# EAGLE design Quad_Board (EAGLE 6.5.0)
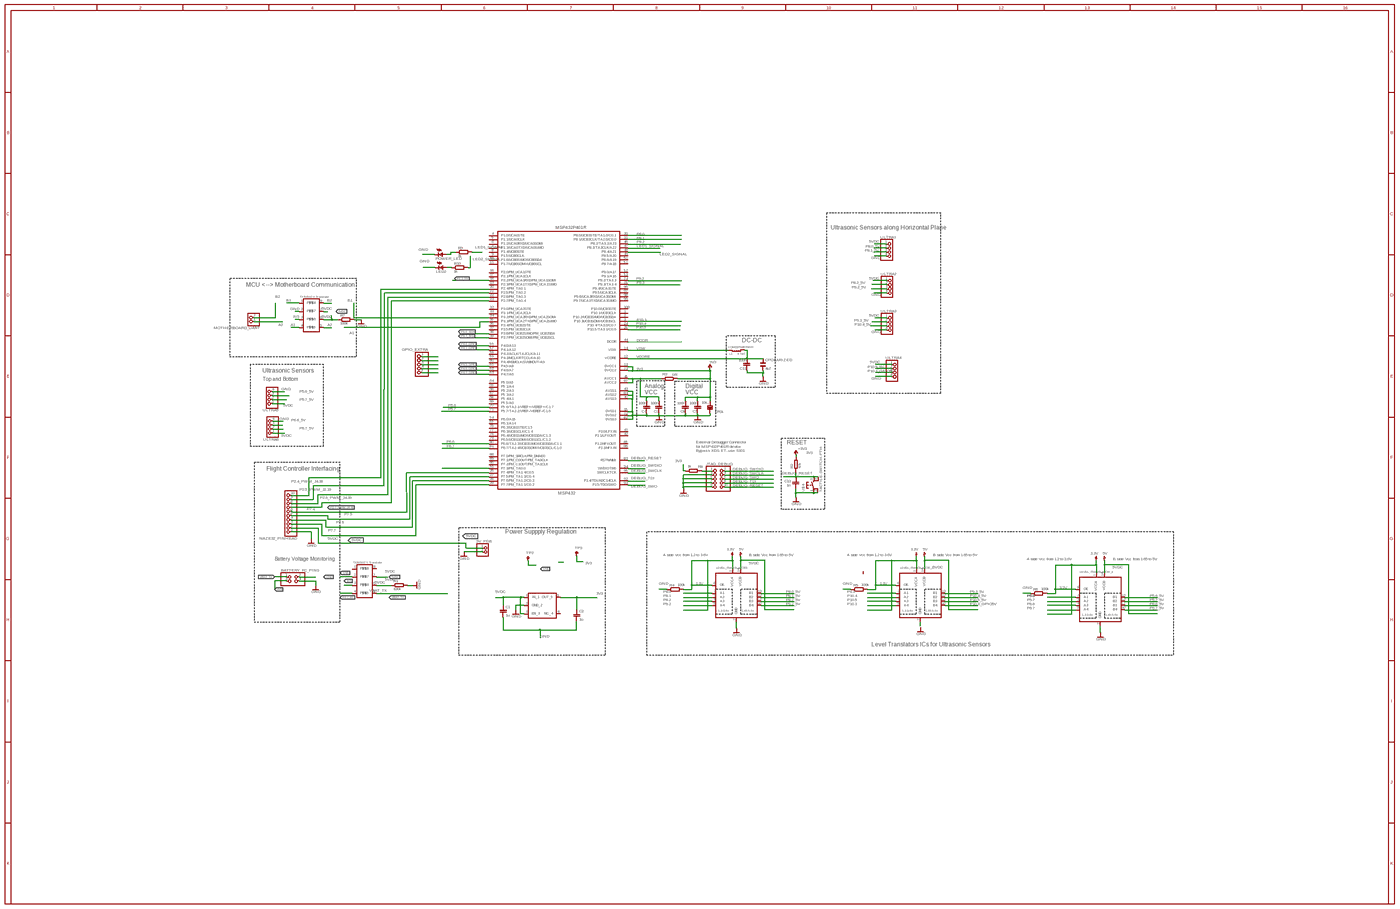
[diagram p0: schematic, sheet 1, overview]
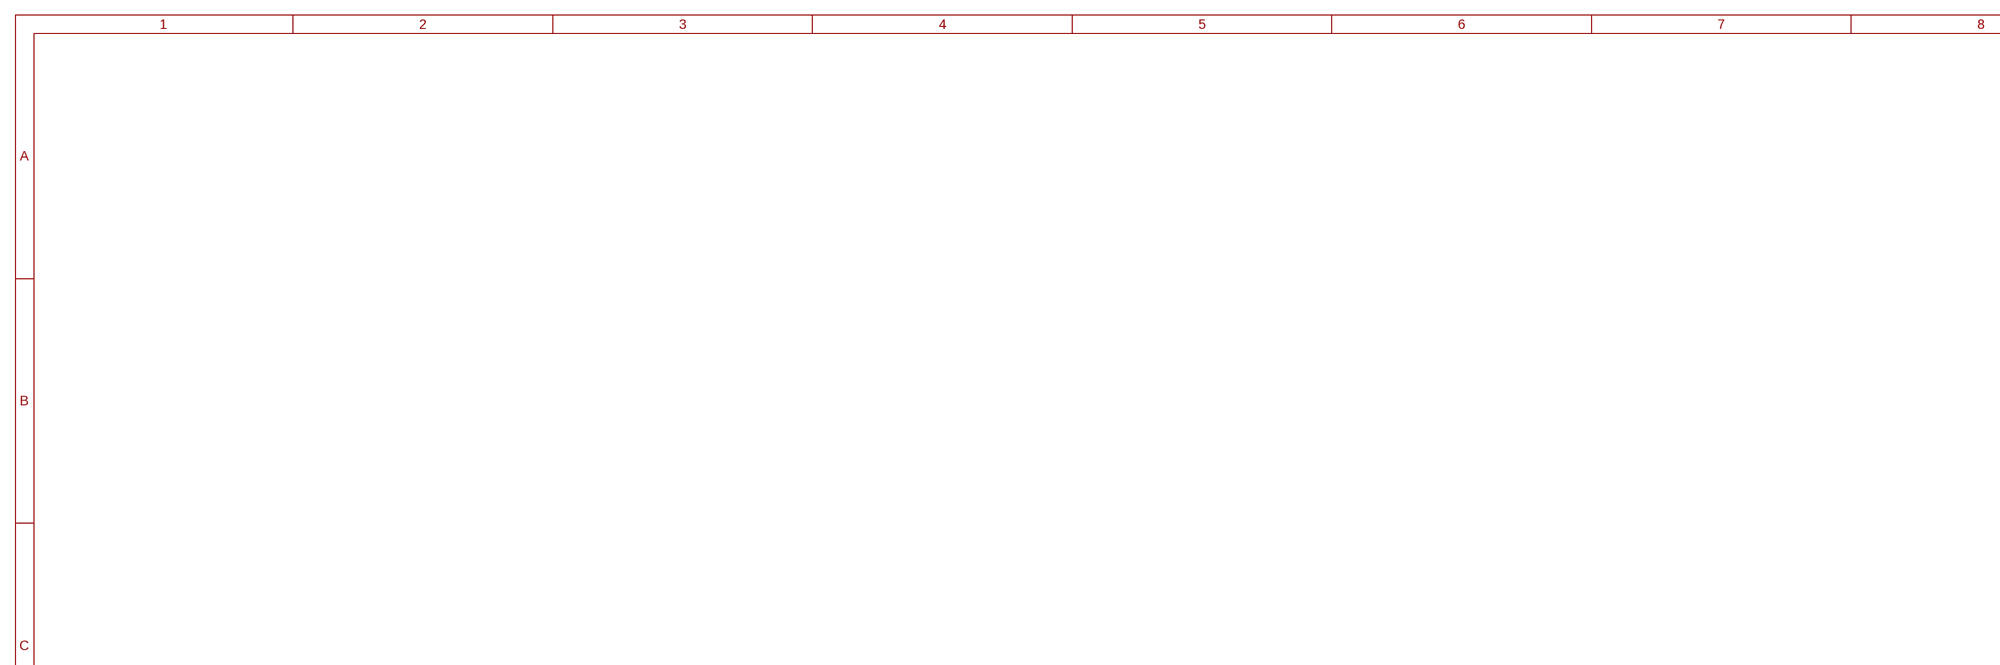
[diagram p1: schematic, sheet 1, part 1 of 4]
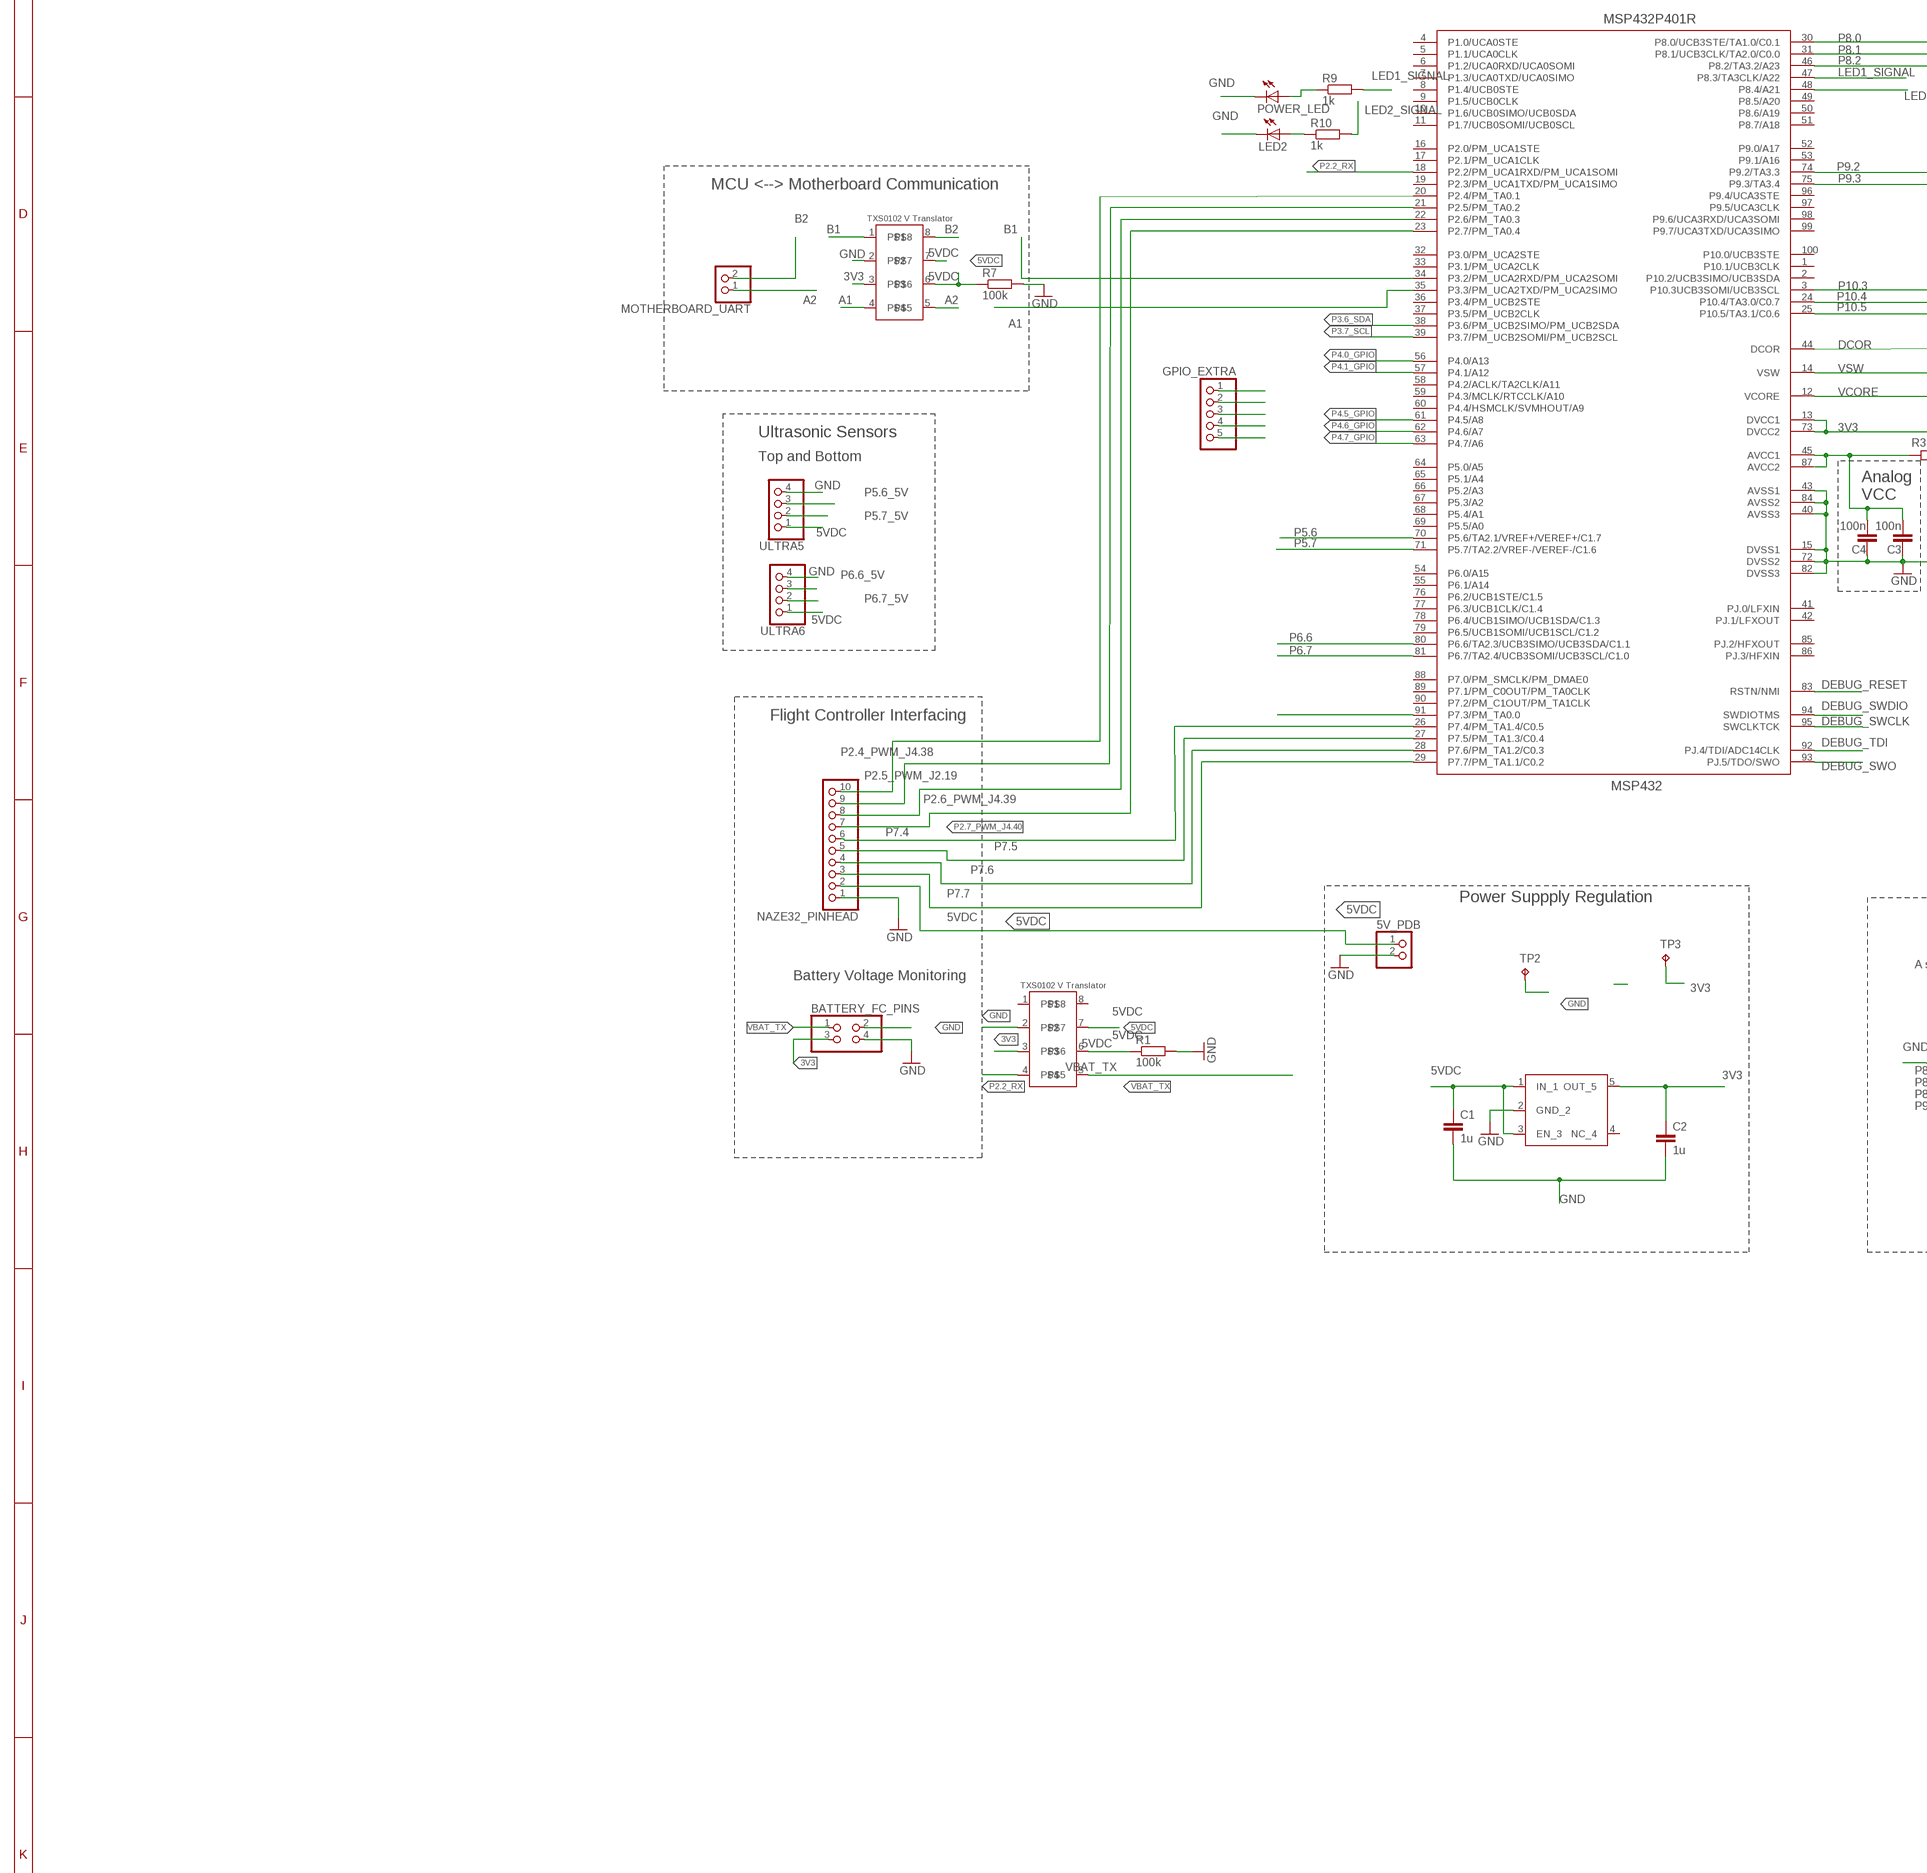
[diagram p2: schematic, sheet 1, part 2 of 4]
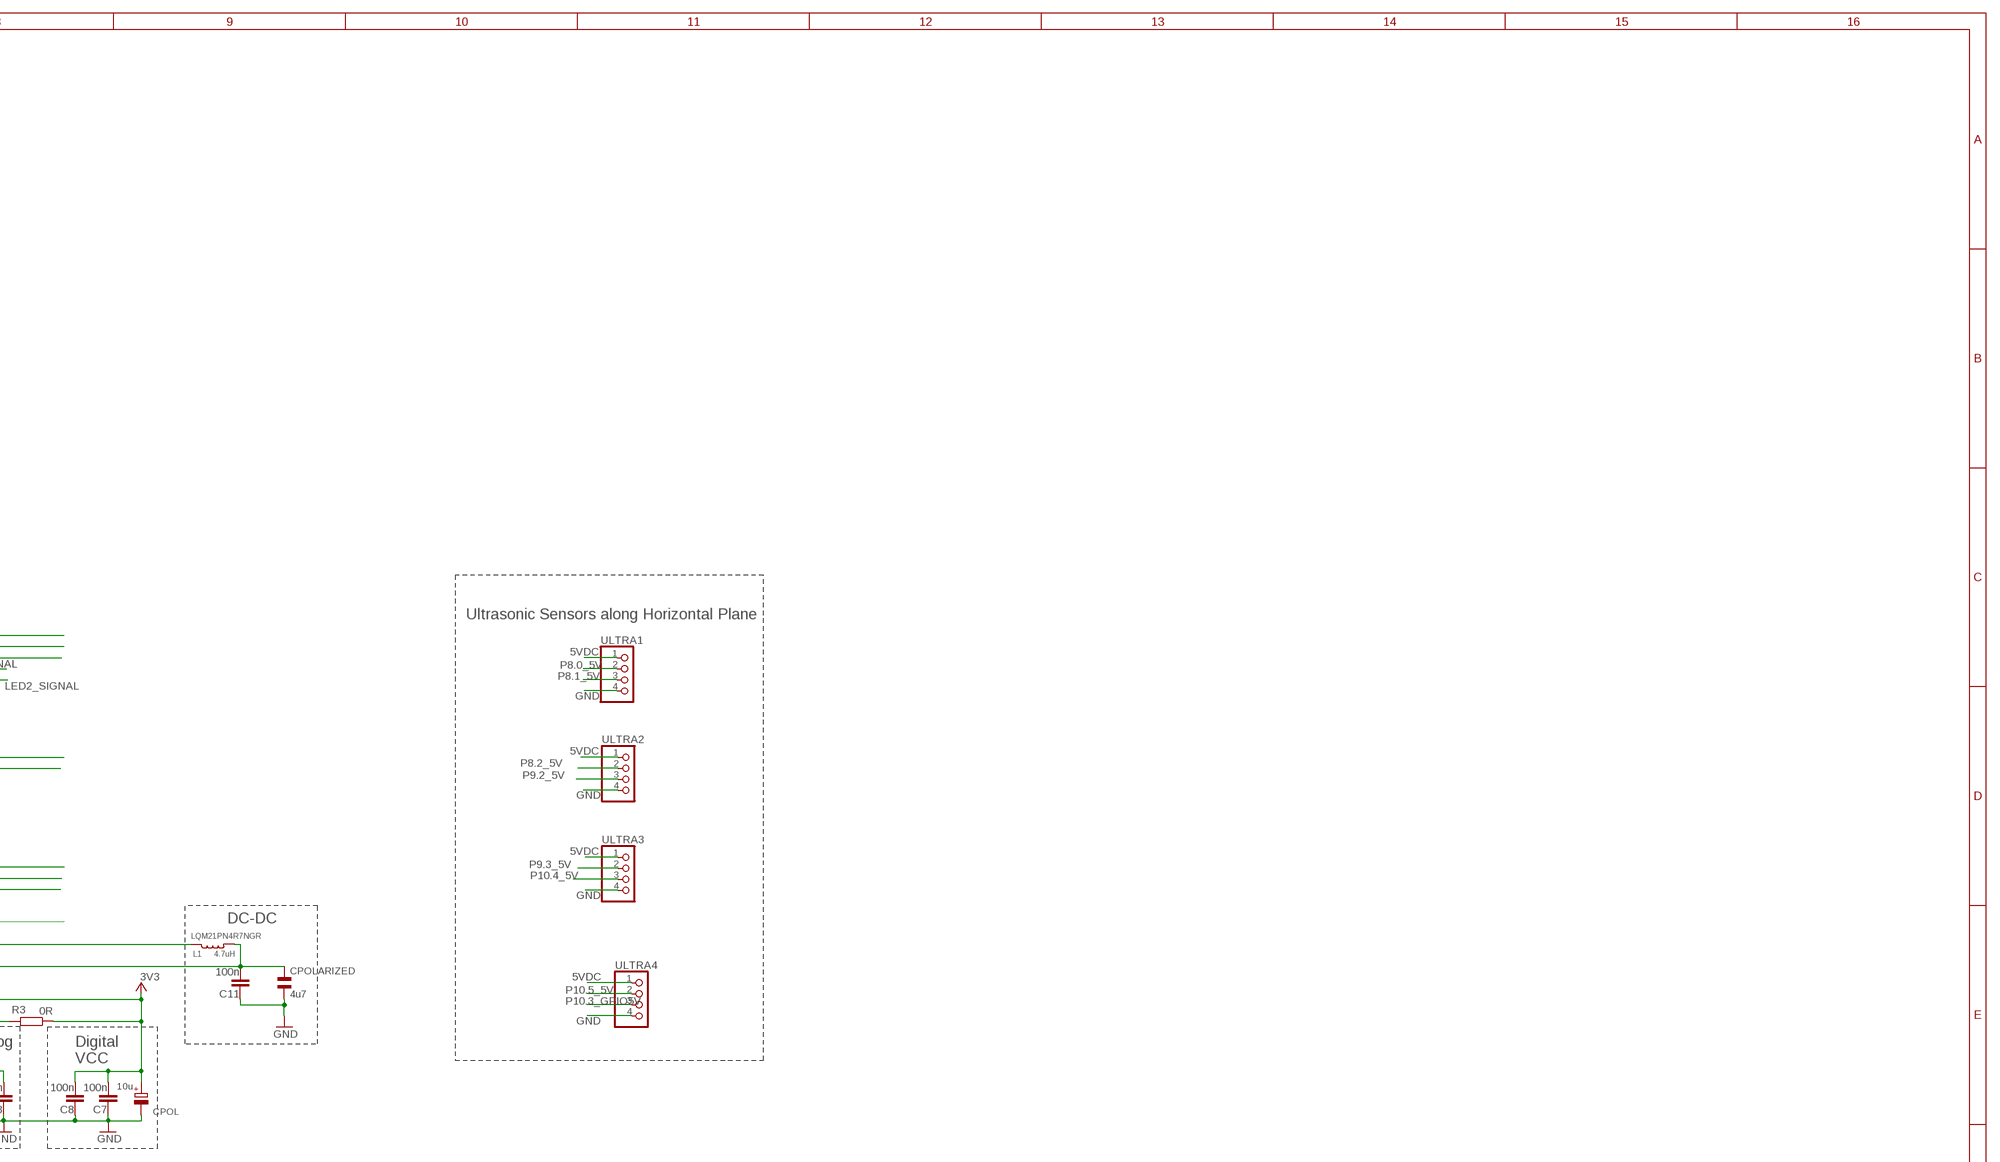
[diagram p3: schematic, sheet 1, part 3 of 4]
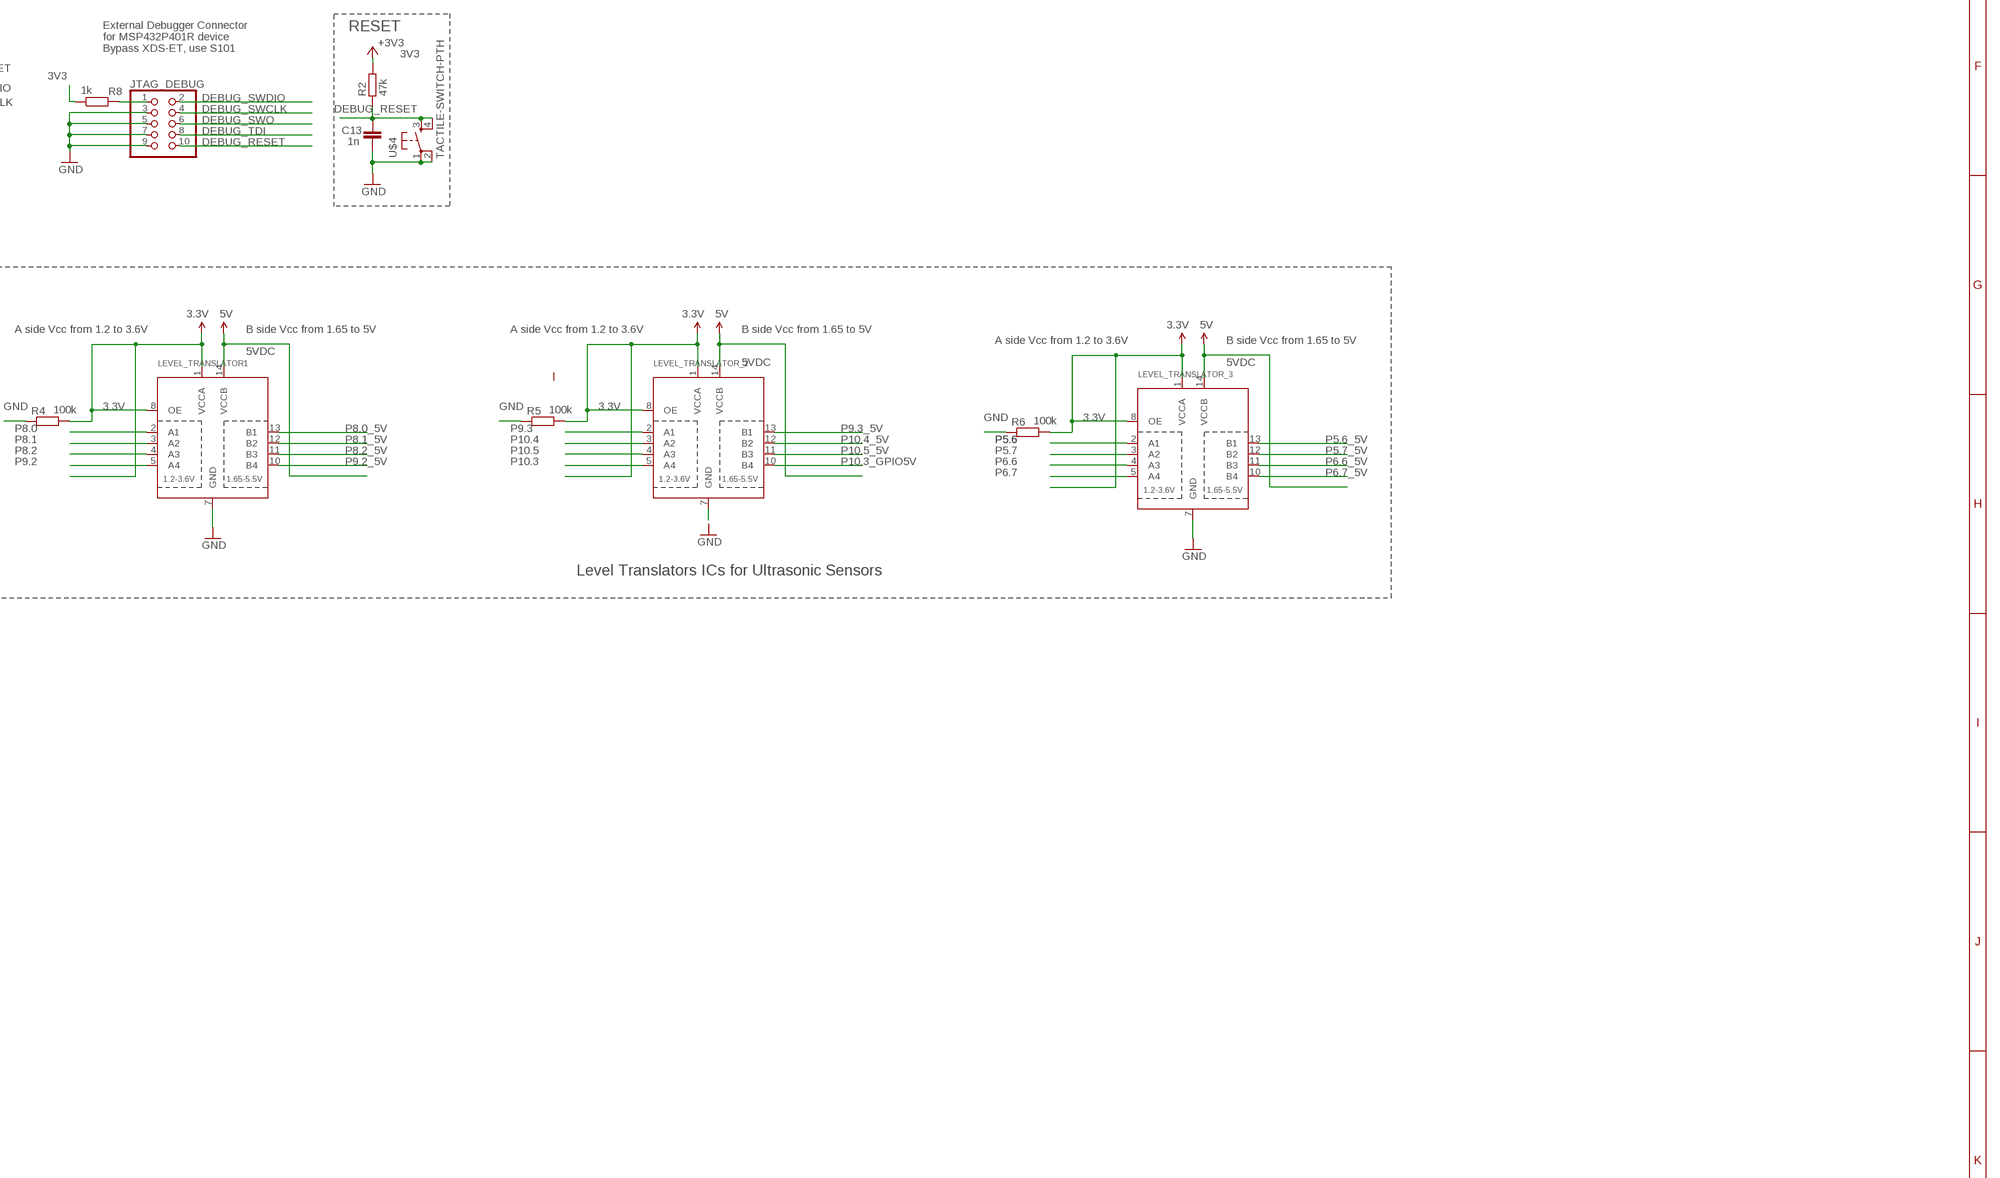
[diagram p4: schematic, sheet 1, part 4 of 4]

## Parts
5V_PDB  PINHD-1X2  [1X02]
BATTERY_FC_PINS  PINHD-2X2  [2X02]
C1  1u  C-EUC0805  [C0805]
C2  1u  C-EUC0805  [C0805]
C3  100n  C-EUC0805  [C0805]
C4  100n  C-EUC0805  [C0805]
C7  100n  C-EUC0805  [C0805]
C8  100n  C-EUC0805  [C0805]
C11  100n  C-EUC0805  [C0805]
C13  1n  C-EUC0805  [C0805]
CPOL  10u  CPOL-EUA/3216-18R  [A/3216-18R]
CPOLARIZED  4u7  CSMD0805  [CSMD0805]
GPIO_EXTRA  PINHD-1X5  [1X05]
JTAG_DEBUG  PINHD-2X5  [2X05]
L1  4.7uH  LQM2MP_G0  [0806]
LED2  LED_E  [LED_1206]
LEVEL_TRANSLATOR1  TXB0104PWRSOIC14  [SO14]
LEVEL_TRANSLATOR_2  TXB0104PWRSOIC14  [SO14]
LEVEL_TRANSLATOR_3  TXB0104PWRSOIC14  [SO14]
MOTHERBOARD_UART  PINHD-1X2  [1X02]
MSP432P401R  MSP432  [PZ100]
NAZE32_PINHEAD  PINHD-1X10  [1X10]
POWER_LED  LED_E  [LED_1206]
R1  100k  R-EU_M1206  [M1206]
R2  47k  R-EU_R1206  [R1206]
R3  0R  R-EU_RM0402  [0402]
R4  100k  R-EU_M1206  [M1206]
R5  100k  R-EU_M1206  [M1206]
R6  100k  R-EU_M1206  [M1206]
R7  100k  R-EU_M1206  [M1206]
R8  1k  R-EU_R1206  [R1206]
R9  1k  R-EU_M0805  [M0805]
R10  1k  R-EU_M0805  [M0805]
TP2  TPB2,54  [B2,54]
TP3  TPB2,54  [B2,54]
U$1  TXS0102  [DCT_R-PDSO-G8]
U$2  TLV733P  [SOT23-5]
U$3  TXS0102  [DCT_R-PDSO-G8]
U$4  TACTILE-SWITCH-PTH  [TAC-SWITCH-PTH]
ULTRA1  PINHD-1X4  [1X04]
ULTRA2  PINHD-1X4  [1X04]
ULTRA3  PINHD-1X4  [1X04]
ULTRA4  PINHD-1X4  [1X04]
ULTRA5  PINHD-1X4  [1X04]
ULTRA6  PINHD-1X4  [1X04]

## Nets
3.3V: LEVEL_TRANSLATOR1.1(VCCA) LEVEL_TRANSLATOR1.8(OE) LEVEL_TRANSLATOR_2.1(VCCA) LEVEL_TRANSLATOR_2.8(OE) LEVEL_TRANSLATOR_3.1(VCCA) LEVEL_TRANSLATOR_3.8(OE) R4.2 R5.2 R6.2
3V3: BATTERY_FC_PINS.3 C2.1 C7.1 C8.1 CPOL.+ MSP432P401R.13(DVCC1) MSP432P401R.73(DVCC2) R2.2 R3.1 R8.1 TP3.TP U$1.3 U$2.5(OUT_5) U$3.3 ; supply symbol labelled +3V3
5VDC: 5V_PDB.1 C1.1 LEVEL_TRANSLATOR1.14(VCCB) LEVEL_TRANSLATOR_2.14(VCCB) LEVEL_TRANSLATOR_3.14(VCCB) NAZE32_PINHEAD.2 R1.1 R7.1 U$1.6 U$1.7 U$2.1(IN_1) U$2.3(EN_3) U$3.6 U$3.7 ULTRA1.1 ULTRA2.1 ULTRA3.1 ULTRA4.1 ULTRA5.1 ULTRA6.1 ; supply symbol labelled 5V
A1: MSP432P401R.35(P3.3/PM_UCA2TXD/PM_UCA2SIMO) U$1.4
A2: MOTHERBOARD_UART.1 U$1.5
B1: MSP432P401R.34(P3.2/PM_UCA2RXD/PM_UCA2SOMI) U$1.1
B2: MOTHERBOARD_UART.2 U$1.8
DCOR: MSP432P401R.44(DCOR)
DEBUG_RESET: C13.1 JTAG_DEBUG.10 MSP432P401R.83(RSTN/NMI) R2.1 U$4.3 U$4.4
DEBUG_SWCLK: JTAG_DEBUG.4 MSP432P401R.95(SWCLKTCK)
DEBUG_SWDIO: JTAG_DEBUG.2 MSP432P401R.94(SWDIOTMS)
DEBUG_SWO: JTAG_DEBUG.6 MSP432P401R.93(PJ.5/TDO/SWO)
DEBUG_TDI: JTAG_DEBUG.8 MSP432P401R.92(PJ.4/TDI/ADC14CLK)
GND: 5V_PDB.2 BATTERY_FC_PINS.2 BATTERY_FC_PINS.4 C1.2 C2.2 C3.2 C4.2 C7.2 C8.2 C11.2 C13.2 CPOL.- CPOLARIZED.2 JTAG_DEBUG.3 JTAG_DEBUG.5 JTAG_DEBUG.7 JTAG_DEBUG.9 LED2.C LEVEL_TRANSLATOR1.7(GND) LEVEL_TRANSLATOR_2.7(GND) LEVEL_TRANSLATOR_3.7(GND) MSP432P401R.15(DVSS1) MSP432P401R.40(AVSS3) MSP432P401R.43(AVSS1) MSP432P401R.72(DVSS2) MSP432P401R.82(DVSS3) MSP432P401R.84(AVSS2) NAZE32_PINHEAD.1 POWER_LED.C R1.2 R4.1 R5.1 R6.1 R7.2 TP2.TP U$1.2 U$2.2(GND_2) U$3.2 U$4.1 U$4.2 ULTRA1.4 ULTRA2.4 ULTRA3.4 ULTRA4.4 ULTRA5.4 ULTRA6.4
LED1_SIGNAL: MSP432P401R.47(P8.3/TA3CLK/A22) R9.2
LED2_SIGNAL: MSP432P401R.48(P8.4/A21) R10.2
N$2: C3.1 C4.1 MSP432P401R.45(AVCC1) MSP432P401R.87(AVCC2) R3.2
N$5: POWER_LED.A R9.1
N$6: LED2.A R10.1
N$14: JTAG_DEBUG.1 R8.2
P2.2_RX: MSP432P401R.18(P2.2/PM_UCA1RXD/PM_UCA1SOMI) U$3.4
P2.4_PWM_J4.38: MSP432P401R.20(P2.4/PM_TA0.1) NAZE32_PINHEAD.10
P2.5_PWM_J2.19: MSP432P401R.21(P2.5/PM_TA0.2) NAZE32_PINHEAD.9
P2.6_PWM_J4.39: MSP432P401R.22(P2.6/PM_TA0.3) NAZE32_PINHEAD.8
P2.7_PWM_J4.40: MSP432P401R.23(P2.7/PM_TA0.4) NAZE32_PINHEAD.7
P3.6_SDA: MSP432P401R.38(P3.6/PM_UCB2SIMO/PM_UCB2SDA)
P3.7_SCL: MSP432P401R.39(P3.7/PM_UCB2SOMI/PM_UCB2SCL)
P4.0_GPIO: GPIO_EXTRA.1 MSP432P401R.56(P4.0/A13)
P4.1_GPIO: GPIO_EXTRA.2 MSP432P401R.57(P4.1/A12)
P4.5_GPIO: GPIO_EXTRA.3 MSP432P401R.61(P4.5/A8)
P4.6_GPIO: GPIO_EXTRA.4 MSP432P401R.62(P4.6/A7)
P4.7_GPIO: GPIO_EXTRA.5 MSP432P401R.63(P4.7/A6)
P5.6: LEVEL_TRANSLATOR_3.2(A1) MSP432P401R.70(P5.6/TA2.1/VREF+/VEREF+/C1.7)
P5.6_5V: LEVEL_TRANSLATOR_3.13(B1) ULTRA5.3
P5.7: LEVEL_TRANSLATOR_3.3(A2) MSP432P401R.71(P5.7/TA2.2/VREF-/VEREF-/C1.6)
P5.7_5V: LEVEL_TRANSLATOR_3.12(B2) ULTRA5.2
P6.6: LEVEL_TRANSLATOR_3.4(A3) MSP432P401R.80(P6.6/TA2.3/UCB3SIMO/UCB3SDA/C1.1)
P6.6_5V: LEVEL_TRANSLATOR_3.11(B3) ULTRA6.3
P6.7: LEVEL_TRANSLATOR_3.5(A4) MSP432P401R.81(P6.7/TA2.4/UCB3SOMI/UCB3SCL/C1.0)
P6.7_5V: LEVEL_TRANSLATOR_3.10(B4) ULTRA6.2
P7.3: MSP432P401R.91(P7.3/PM_TA0.0)
P7.4: MSP432P401R.26(P7.4/PM_TA1.4/C0.5) NAZE32_PINHEAD.6
P7.5: MSP432P401R.27(P7.5/PM_TA1.3/C0.4) NAZE32_PINHEAD.5
P7.6: MSP432P401R.28(P7.6/PM_TA1.2/C0.3) NAZE32_PINHEAD.4
P7.7: MSP432P401R.29(P7.7/PM_TA1.1/C0.2) NAZE32_PINHEAD.3
P8.0: LEVEL_TRANSLATOR1.2(A1) MSP432P401R.30(P8.0/UCB3STE/TA1.0/C0.1)
P8.0_5V: LEVEL_TRANSLATOR1.13(B1) ULTRA1.2
P8.1: LEVEL_TRANSLATOR1.3(A2) MSP432P401R.31(P8.1/UCB3CLK/TA2.0/C0.0)
P8.1_5V: LEVEL_TRANSLATOR1.12(B2) ULTRA1.3
P8.2: LEVEL_TRANSLATOR1.4(A3) MSP432P401R.46(P8.2/TA3.2/A23)
P8.2_5V: LEVEL_TRANSLATOR1.11(B3) ULTRA2.2
P9.2: LEVEL_TRANSLATOR1.5(A4) MSP432P401R.74(P9.2/TA3.3)
P9.2_5V: LEVEL_TRANSLATOR1.10(B4) ULTRA2.3
P9.3: LEVEL_TRANSLATOR_2.2(A1) MSP432P401R.75(P9.3/TA3.4)
P9.3_5V: LEVEL_TRANSLATOR_2.13(B1) ULTRA3.2
P10.3: LEVEL_TRANSLATOR_2.5(A4) MSP432P401R.3(P10.3UCB3SOMI/UCB3SCL)
P10.3_GPIO5V: LEVEL_TRANSLATOR_2.10(B4) ULTRA4.3
P10.4: LEVEL_TRANSLATOR_2.3(A2) MSP432P401R.24(P10.4/TA3.0/C0.7)
P10.4_5V: LEVEL_TRANSLATOR_2.12(B2) ULTRA3.3
P10.5: LEVEL_TRANSLATOR_2.4(A3) MSP432P401R.25(P10.5/TA3.1/C0.6)
P10.5_5V: LEVEL_TRANSLATOR_2.11(B3) ULTRA4.2
VBAT_TX: BATTERY_FC_PINS.1 U$3.5
VCORE: C11.1 CPOLARIZED.1 L1.1 MSP432P401R.12(VCORE)
VSW: L1.2 MSP432P401R.14(VSW)
Unconnected: U$2.4(NC_4) U$3.1 U$3.8

## Notes on the sheet
- Ultrasonic Sensors along Horizontal Plane
- MCU <--> Motherboard Communication
- DC-DC
- LQM21PN4R7NGR
- Ultrasonic Sensors
- Top and Bottom
- Analog | Digital
- VCC | VCC
- RESET
- External Debugger Connector
  for MSP432P401R device
  Bypass XDS-ET, use S101
- Flight Controller Interfacing
- Power Suppply Regulation
- A side Vcc from 1.2 to 3.6V | B side Vcc from 1.65 to 5V | A side Vcc from 1.2 to 3.6V | B side Vcc from 1.65 to 5V
- Battery Voltage Monitoring | A side Vcc from 1.2 to 3.6V | B side Vcc from 1.65 to 5V
- Level Translators ICs for Ultrasonic Sensors

## Power pins joined to a net without a drawn wire
P1.0/UCA0STE: MSP432P401R.4(P1.0/UCA0STE)
P1.1/UCA0CLK: MSP432P401R.5(P1.1/UCA0CLK)
P1.2/UCA0RXD/UCA0SOMI: MSP432P401R.6(P1.2/UCA0RXD/UCA0SOMI)
P1.3/UCA0TXD/UCA0SIMO: MSP432P401R.7(P1.3/UCA0TXD/UCA0SIMO)
P1.4/UCB0STE: MSP432P401R.8(P1.4/UCB0STE)
P1.5/UCB0CLK: MSP432P401R.9(P1.5/UCB0CLK)
P1.6/UCB0SIMO/UCB0SDA: MSP432P401R.10(P1.6/UCB0SIMO/UCB0SDA)
P1.7/UCB0SOMI/UCB0SCL: MSP432P401R.11(P1.7/UCB0SOMI/UCB0SCL)
P2.0/PM_UCA1STE: MSP432P401R.16(P2.0/PM_UCA1STE)
P2.1/PM_UCA1CLK: MSP432P401R.17(P2.1/PM_UCA1CLK)
P2.3/PM_UCA1TXD/PM_UCA1SIMO: MSP432P401R.19(P2.3/PM_UCA1TXD/PM_UCA1SIMO)
P3.0/PM_UCA2STE: MSP432P401R.32(P3.0/PM_UCA2STE)
P3.1/PM_UCA2CLK: MSP432P401R.33(P3.1/PM_UCA2CLK)
P3.4/PM_UCB2STE: MSP432P401R.36(P3.4/PM_UCB2STE)
P3.5/PM_UCB2CLK: MSP432P401R.37(P3.5/PM_UCB2CLK)
P4.2/ACLK/TA2CLK/A11: MSP432P401R.58(P4.2/ACLK/TA2CLK/A11)
P4.3/MCLK/RTCCLK/A10: MSP432P401R.59(P4.3/MCLK/RTCCLK/A10)
P4.4/HSMCLK/SVMHOUT/A9: MSP432P401R.60(P4.4/HSMCLK/SVMHOUT/A9)
P5.0/A5: MSP432P401R.64(P5.0/A5)
P5.1/A4: MSP432P401R.65(P5.1/A4)
P5.2/A3: MSP432P401R.66(P5.2/A3)
P5.3/A2: MSP432P401R.67(P5.3/A2)
P5.4/A1: MSP432P401R.68(P5.4/A1)
P5.5/A0: MSP432P401R.69(P5.5/A0)
P6.0/A15: MSP432P401R.54(P6.0/A15)
P6.1/A14: MSP432P401R.55(P6.1/A14)
P6.2/UCB1STE/C1.5: MSP432P401R.76(P6.2/UCB1STE/C1.5)
P6.3/UCB1CLK/C1.4: MSP432P401R.77(P6.3/UCB1CLK/C1.4)
P6.4/UCB1SIMO/UCB1SDA/C1.3: MSP432P401R.78(P6.4/UCB1SIMO/UCB1SDA/C1.3)
P6.5/UCB1SOMI/UCB1SCL/C1.2: MSP432P401R.79(P6.5/UCB1SOMI/UCB1SCL/C1.2)
P7.0/PM_SMCLK/PM_DMAE0: MSP432P401R.88(P7.0/PM_SMCLK/PM_DMAE0)
P7.1/PM_C0OUT/PM_TA0CLK: MSP432P401R.89(P7.1/PM_C0OUT/PM_TA0CLK)
P7.2/PM_C1OUT/PM_TA1CLK: MSP432P401R.90(P7.2/PM_C1OUT/PM_TA1CLK)
P8.5/A20: MSP432P401R.49(P8.5/A20)
P8.6/A19: MSP432P401R.50(P8.6/A19)
P8.7/A18: MSP432P401R.51(P8.7/A18)
P9.0/A17: MSP432P401R.52(P9.0/A17)
P9.1/A16: MSP432P401R.53(P9.1/A16)
P9.4/UCA3STE: MSP432P401R.96(P9.4/UCA3STE)
P9.5/UCA3CLK: MSP432P401R.97(P9.5/UCA3CLK)
P9.6/UCA3RXD/UCA3SOMI: MSP432P401R.98(P9.6/UCA3RXD/UCA3SOMI)
P9.7/UCA3TXD/UCA3SIMO: MSP432P401R.99(P9.7/UCA3TXD/UCA3SIMO)
P10.0/UCB3STE: MSP432P401R.100(P10.0/UCB3STE)
P10.1/UCB3CLK: MSP432P401R.1(P10.1/UCB3CLK)
P10.2/UCB3SIMO/UCB3SDA: MSP432P401R.2(P10.2/UCB3SIMO/UCB3SDA)
PJ.0/LFXIN: MSP432P401R.41(PJ.0/LFXIN)
PJ.1/LFXOUT: MSP432P401R.42(PJ.1/LFXOUT)
PJ.2/HFXOUT: MSP432P401R.85(PJ.2/HFXOUT)
PJ.3/HFXIN: MSP432P401R.86(PJ.3/HFXIN)

## Library data of the parts
5V_PDB MOTHERBOARD_UART = pinhead:PINHD-1X2: PIN HEADER
BATTERY_FC_PINS = pinhead:PINHD-2X2: PIN HEADER
C1-C4 C7 C8 C11 C13 = rcl:C-EU: CAPACITOR, European symbol
CPOL = rcl:CPOL-EU: POLARIZED CAPACITOR, European symbol
CPOLARIZED = cap:CSMD0805
GPIO_EXTRA = pinhead:PINHD-1X5: PIN HEADER
JTAG_DEBUG = pinhead:PINHD-2X5: PIN HEADER
L1 = Murata:LQM2MP_G0
LED2 POWER_LED = eagle-ltspice:LED_E: LED Source: http://www.osram.convergy.de Source: www.luxeon.com Source: www.kingbright.com; SPICEMODEL: NONE; SPICEPREFIX: D; SPICETYPE: diode
LEVEL_TRANSLATOR1 LEVEL_TRANSLATOR_2 LEVEL_TRANSLATOR_3 = SparkFun-DigitalIC:TXB0104PWR: 4-Bit Bi-Directional Level Shifter 1.2V-3.6V (VCCA) to 1.65V-5.5V (VCCB) bi-directional level shifter with auto direction sensing. Max data rate - VCCA 1.8V: 20Mbps (50ns), VCCA 3.3V: 100Mbps (10ns) Digikey: 296-21929-1-ND (TSSOP) IC-11329; PROD_ID: IC-11329
MSP432P401R = MSP-EXP432:MSP432
NAZE32_PINHEAD = pinhead:PINHD-1X10: PIN HEADER
R1 R4-R7 R9 R10 = resistor:R-EU_: RESISTOR, European symbol
R2 R3 R8 = rcl:R-EU_: RESISTOR, European symbol
TP2 TP3 = testpad:TP: Test pad
U$1 U$3 = TXS0102-bi-directional-translator:TXS0102: Texas Instruments Bi-Driectional Voltage Level Translator Reference - http://www.ti.com/lit/ds/symlink/txs0102.pdf
U$2 = texas:TLV733P: Low Dropout Voltage LDO (Capacitor Free) 300mA 3.3V
U$4 = GeekAmmo:TACTILE-SWITCH: Tactile Switch 4 Pins, SPST NO
ULTRA1-ULTRA6 = pinhead:PINHD-1X4: PIN HEADER

## Net classes
0 default: width 0.254 mm

## Board
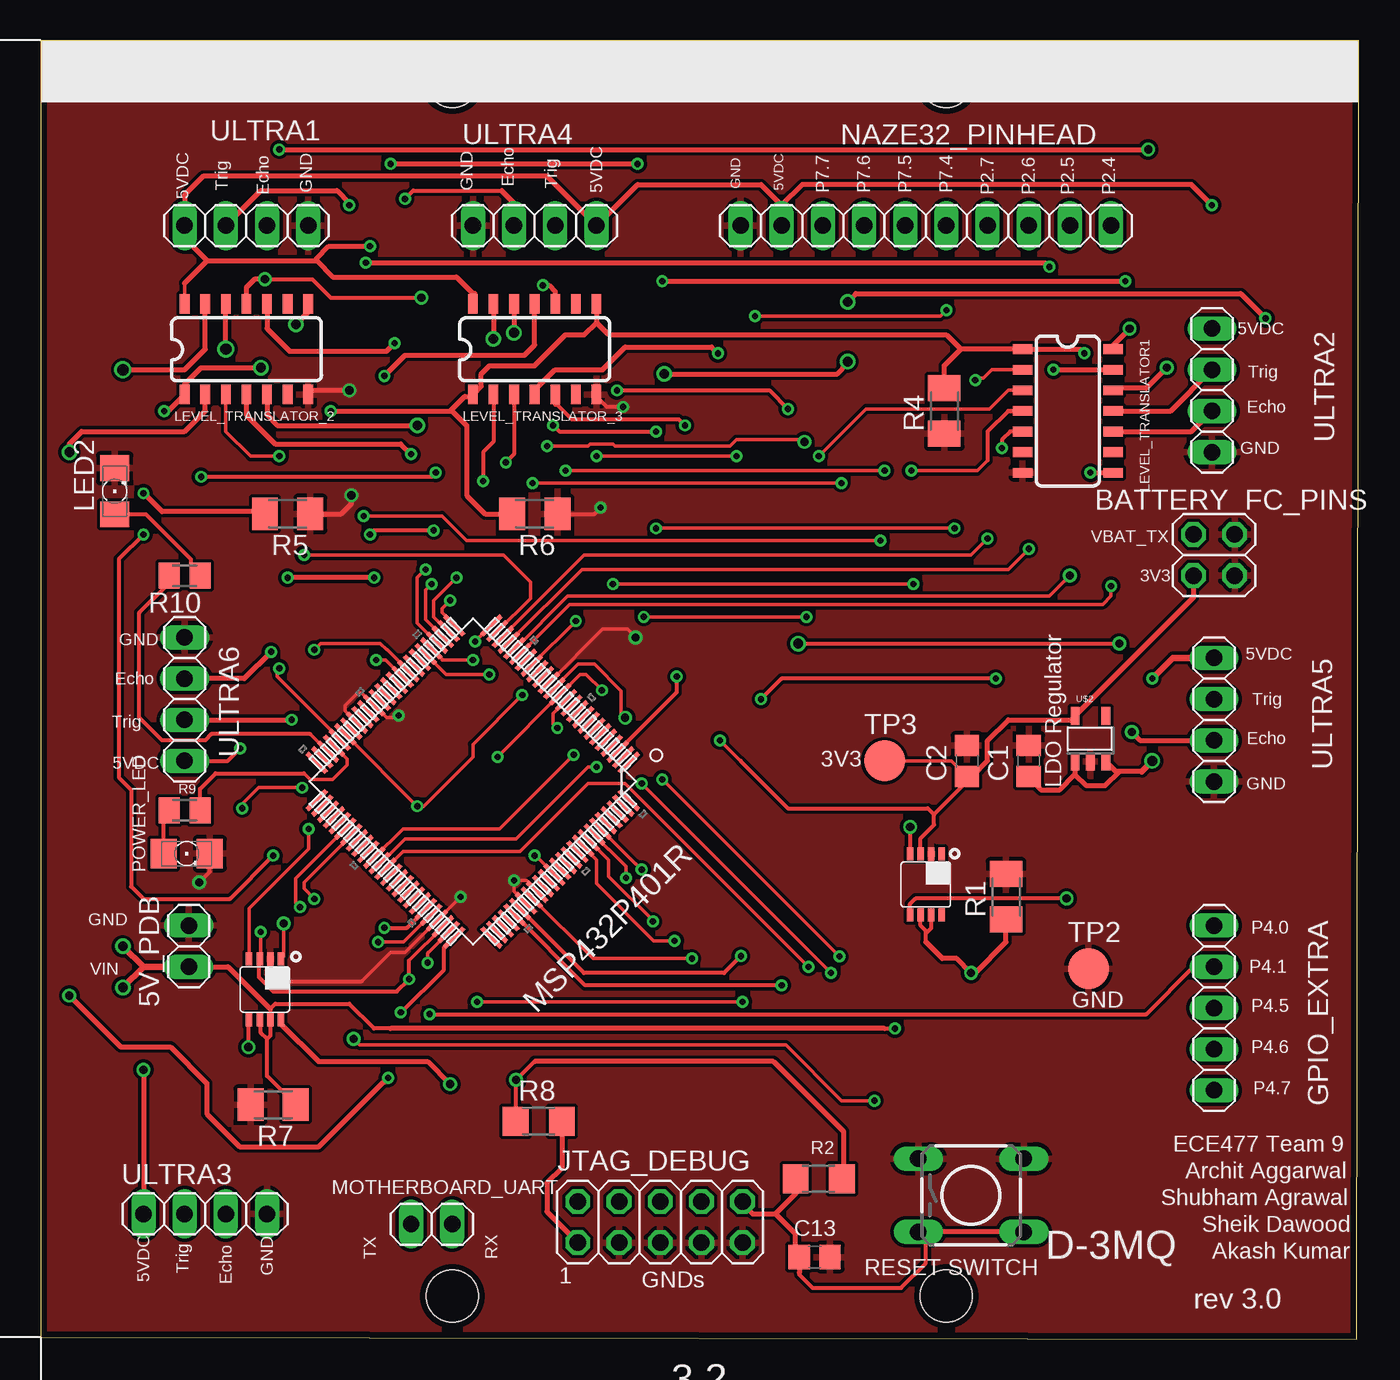
[diagram p5: board, top side]
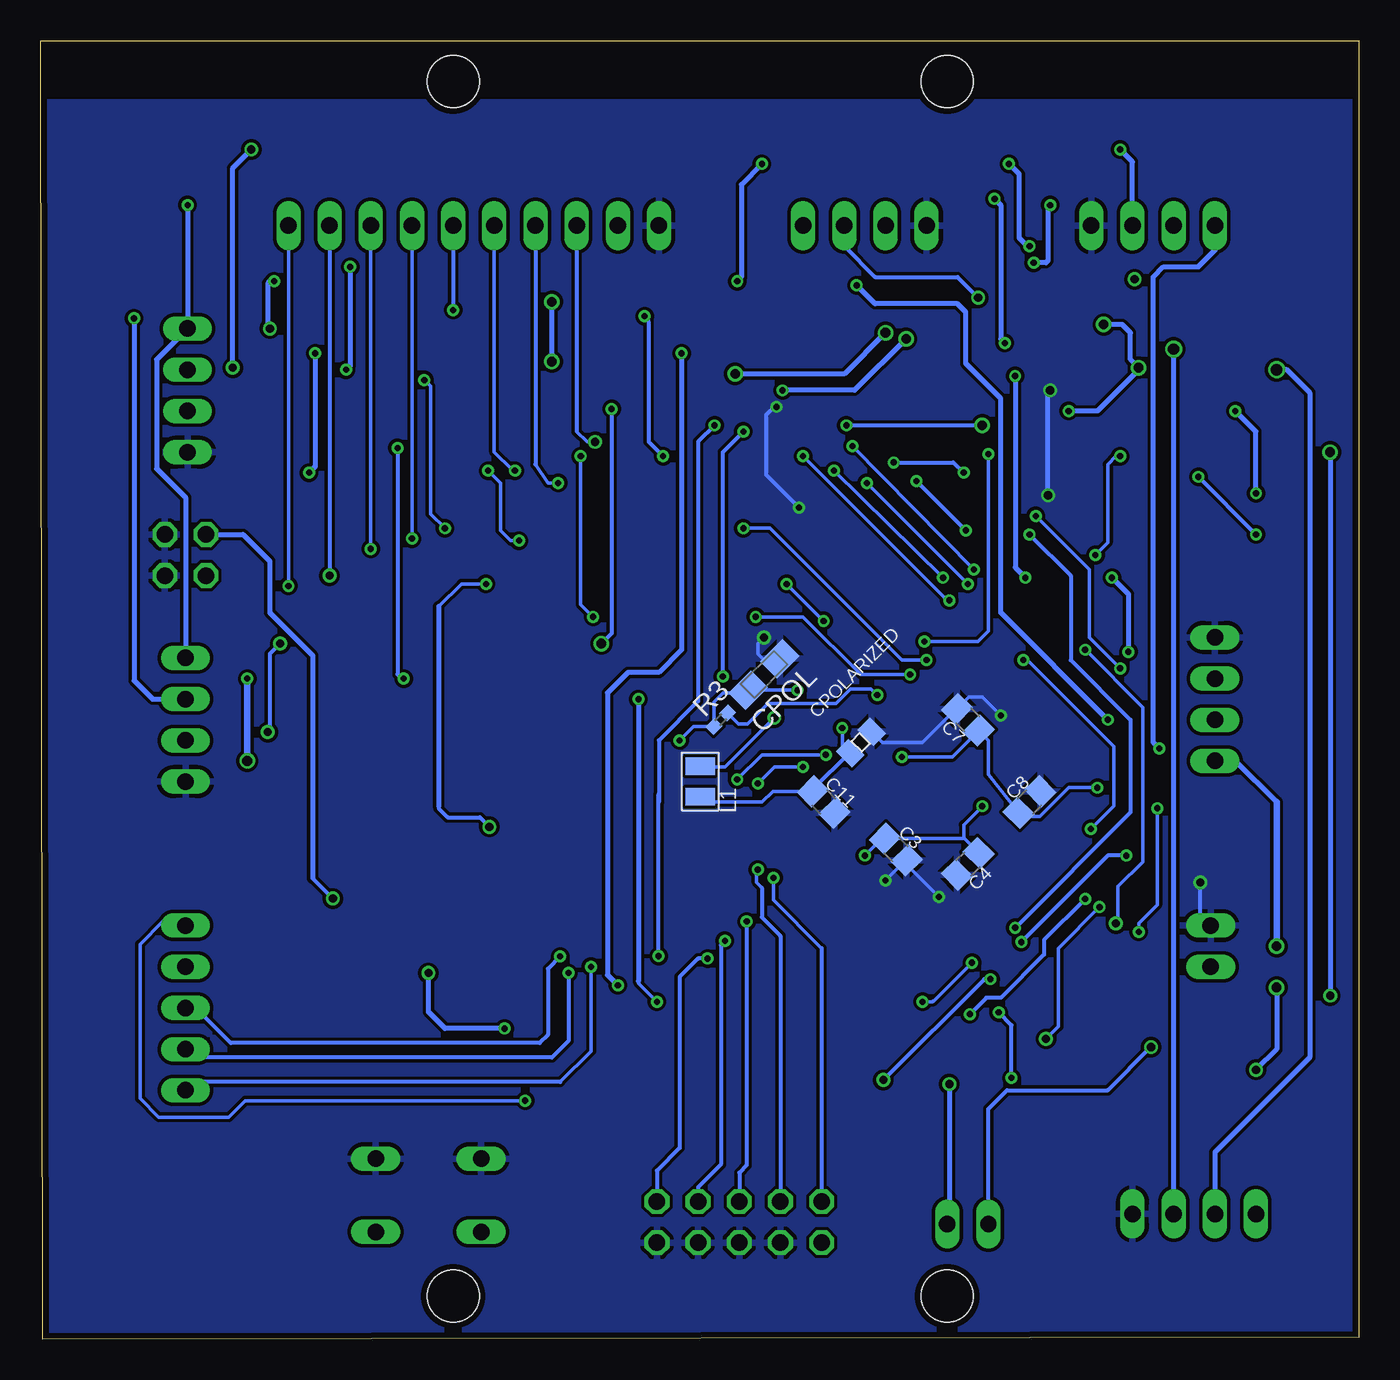
[diagram p6: board, bottom side, seen from below]

Size 81.33 x 80.13 mm. Coordinates in mm from the lower left corner, seen from the top.
Outline: 0,0.13 81.2,0 81.33,80.13 0,80.13 0,0.13
Copper layers (1*16): Top 0.0356mm / dielectric 1.5011mm / Bottom 0.0356mm
Design rules "ECE_Senior_Design": minimum track width 8mil, minimum drill 13mil, track to track 8mil, track to pad 8mil, pad to pad 6mil, via to via 8mil, smd to smd 6mil, copper to edge 15mil, drill to drill 8mil, minimum pad ring 7mil, minimum via ring 7mil, stop-mask expansion 3mil, vias tented up to drill 0mil, thermal gap 10mil
Holes 3.2 mm at 25.4,2.67 55.88,2.67 55.88,77.6 25.4,77.6

### Footprints (pad centres in the part's own frame; a part is rotated, then mirrored left to right if it is on the bottom)
1X02 = drill 1.016 long: 1 -1.27,0; 2 1.27,0
2X02 = drill 1.016 octagon: 1 -1.27,-1.27; 2 -1.27,1.27; 3 1.27,-1.27; 4 1.27,1.27
C0805 = smd 1.3 x 1.5: 1 -0.95,0; 2 0.95,0
A/3216-18R = smd 1.95 x 1.5: + 1.375,0; - -1.375,0
CSMD0805 = smd 1.092 x 1.397: 1 -0.94,0; 2 0.94,0
1X05 = drill 1.016 long: 1 -5.08,0; 2 -2.54,0; 3 0,0; 4 2.54,0; 5 5.08,0
2X05 = drill 1.016 octagon: 1 -5.08,-1.27; 2 -5.08,1.27; 3 -2.54,-1.27; 4 -2.54,1.27; 5 0,-1.27; 6 0,1.27; 7 2.54,-1.27; 8 2.54,1.27; 9 5.08,-1.27; 10 5.08,1.27
0806 = smd 1.1 x 1.8: 1 -0.94,0; 2 0.94,0
LED_1206 = smd 1.6 x 1.803: A -1.422,0; C 1.422,0
SO14 = smd 0.6 x 1.2: 1 -3.81,-2.8; 2 -2.54,-2.8; 3 -1.27,-2.8; 4 0,-2.8; 5 1.27,-2.8; 6 2.54,-2.8; 7 3.81,-2.8; 8 3.81,2.8; 9 2.54,2.8; 10 1.27,2.8; 11 0,2.8; 12 -1.27,2.8; 13 -2.54,2.8; 14 -3.81,2.8
PZ100 = smd 1.676 x 0.279: 1 -7.62,5.994; 2 -7.62,5.512; 3 -7.62,5.004; 4 -7.62,4.496; 5 -7.62,3.988; 6 -7.62,3.505; 7 -7.62,2.997; 8 -7.62,2.489; 9 -7.62,2.007; 10 -7.62,1.499; 11 -7.62,0.991; 12 -7.62,0.508; 13 -7.62,0; 14 -7.62,-0.508; 15 -7.62,-0.991; 16 -7.62,-1.499; 17 -7.62,-2.007; 18 -7.62,-2.489; 19 -7.62,-2.997; 20 -7.62,-3.505; 21 -7.62,-3.988; 22 -7.62,-4.496; 23 -7.62,-5.004; 24 -7.62,-5.512; 25 -7.62,-5.994; 51 7.62,-5.994; 52 7.62,-5.512; 53 7.62,-5.004; 54 7.62,-4.496; 55 7.62,-3.988; 56 7.62,-3.505; 57 7.62,-2.997; 58 7.62,-2.489; 59 7.62,-2.007; 60 7.62,-1.499; 61 7.62,-0.991; 62 7.62,-0.508; 63 7.62,0; 64 7.62,0.508; 65 7.62,0.991; 66 7.62,1.499; 67 7.62,2.007; 68 7.62,2.489; 69 7.62,2.997; 70 7.62,3.505; 71 7.62,3.988; 72 7.62,4.496; 73 7.62,5.004; 74 7.62,5.512; 75 7.62,5.994 | smd 0.279 x 1.676: 26 -5.994,-7.62; 27 -5.512,-7.62; 28 -5.004,-7.62; 29 -4.496,-7.62; 30 -3.988,-7.62; 31 -3.505,-7.62; 32 -2.997,-7.62; 33 -2.489,-7.62; 34 -2.007,-7.62; 35 -1.499,-7.62; 36 -0.991,-7.62; 37 -0.508,-7.62; 38 0,-7.62; 39 0.508,-7.62; 40 0.991,-7.62; 41 1.499,-7.62; 42 2.007,-7.62; 43 2.489,-7.62; 44 2.997,-7.62; 45 3.505,-7.62; 46 3.988,-7.62; 47 4.496,-7.62; 48 5.004,-7.62; 49 5.512,-7.62; 50 5.994,-7.62; 76 5.994,7.62; 77 5.512,7.62; 78 5.004,7.62; 79 4.496,7.62; 80 3.988,7.62; 81 3.505,7.62; 82 2.997,7.62; 83 2.489,7.62; 84 2.007,7.62; 85 1.499,7.62; 86 0.991,7.62; 87 0.508,7.62; 88 0,7.62; 89 -0.508,7.62; 90 -0.991,7.62; 91 -1.499,7.62; 92 -2.007,7.62; 93 -2.489,7.62; 94 -2.997,7.62; 95 -3.505,7.62; 96 -3.988,7.62; 97 -4.496,7.62; 98 -5.004,7.62; 99 -5.512,7.62; 100 -5.994,7.62
1X10 = drill 1.016 long: 1 -11.43,0; 2 -8.89,0; 3 -6.35,0; 4 -3.81,0; 5 -1.27,0; 6 1.27,0; 7 3.81,0; 8 6.35,0; 9 8.89,0; 10 11.43,0
M1206 = smd 1.6 x 2: 1 -1.4,0; 2 1.4,0
R1206 = smd 1.6 x 1.803: 1 -1.422,0; 2 1.422,0
0402 = smd 0.8 x 0.7: 1 -0.6,0; 2 0.6,0
M0805 = smd 1.3 x 1.6: 1 -0.95,0; 2 0.95,0
B2,54 = smd 2.54 x 2.54: TP 0,0
DCT_R-PDSO-G8 = smd 0.4 x 0.8: 1 -0.975,-1.875; 2 -0.325,-1.875; 3 0.325,-1.875; 4 0.975,-1.875; 5 0.975,1.875; 6 0.325,1.875; 7 -0.325,1.875; 8 -0.975,1.875
SOT23-5 = smd 0.55 x 1.1: 1 -0.95,-1.3; 2 0,-1.3; 3 0.95,-1.3; 4 0.95,1.5; 5 -0.95,1.5
TAC-SWITCH-PTH = drill 1.016 pad 1.524 long: 1 -3.251,2.261; 2 3.251,2.261; 3 -3.251,-2.261; 4 3.251,-2.261
1X04 = drill 1.016 long: 1 -3.81,0; 2 -1.27,0; 3 1.27,0; 4 3.81,0

### Placement (x,y rotation side)
5V_PDB  9.14,24.26 90 top
BATTERY_FC_PINS  72.39,48.39 270 top
C1  60.96,35.69 90 top
C2  57.15,35.69 90 top
C3  28.57,30.23 315 bottom
C4  24.13,29.34 225 bottom
C7  24.13,38.23 135 bottom
C8  20.32,33.15 45 bottom
C11  33.02,33.15 315 bottom
C13  47.75,5.08 0 top
CPOL  36.7,41.02 225 bottom
CPOLARIZED  30.73,36.83 45 bottom
GPIO_EXTRA  72.39,20.45 270 top
JTAG_DEBUG  38.23,7.24 0 top
L1  40.64,34.42 90 bottom
LED2  4.57,52.32 90 top
LEVEL_TRANSLATOR1  63.37,57.28 270 top
LEVEL_TRANSLATOR_2  12.7,61.09 0 top
LEVEL_TRANSLATOR_3  30.48,61.09 0 top
MOTHERBOARD_UART  24.13,7.11 0 top
MSP432P401R  26.67,34.42 225 top
NAZE32_PINHEAD  54.61,68.71 0 top
POWER_LED  9.02,29.97 0 top
R1  59.56,27.3 90 top
R2  48.01,9.91 0 top
R3  39.37,38.23 45 bottom
R4  55.75,57.28 90 top
R5  15.24,50.93 180 top
R6  30.48,50.93 180 top
R7  14.35,14.48 180 top
R8  30.73,13.46 0 top
R9  8.89,32.64 0 top
R10  8.89,47.12 180 top
TP2  64.64,22.86 0 top
TP3  52.07,35.69 0 top
U$1  13.84,21.59 180 top
U$2  64.77,36.96 0 top
U$3  54.61,28.07 180 top
U$4  57.4,8.89 0 top
ULTRA1  12.7,68.71 0 top
ULTRA2  72.26,58.55 270 top
ULTRA3  10.16,7.75 0 top
ULTRA4  30.48,68.71 180 top
ULTRA5  72.39,38.23 270 top
ULTRA6  8.89,39.5 90 top

### Tracks (layer width: path | path; a pad name or v marks a point on that pad's centre or on a via)
3.3V  (via drill 0.38, 0.6)
  Top 0.203: 16.51,63.37 LEVEL_TRANSLATOR_2.8
  Top 0.254: 13.97,51.06 R5.2
  Top 0.305: v13.59,59.94 9.91,59.94 8.89,58.93 LEVEL_TRANSLATOR_2.1 7.88,57.28 v7.62,57.28 | v15.75,62.61 16.51,63.37 | 56.76,61.09 LEVEL_TRANSLATOR1.1 64.14,61.09 v64.39,60.83 | v17.91,57.28 25.27,57.28 | 34.29,62.74 33.53,61.98 32.38,61.98 30.48,60.07 27.69,60.07 27.18,59.56 27.18,58.8 LEVEL_TRANSLATOR_3.1 26.55,58.17 26.16,58.17 25.27,57.28 | 34.29,62.74 35.05,61.98 55.87,61.98 56.76,61.09 | v64.77,53.47 LEVEL_TRANSLATOR1.8 | R4.2 55.75,60.08 56.76,61.09 | 13.97,51.06 7.49,51.06 v6.35,52.2 | 25.27,57.28 25.4,57.28 26.29,56.39 26.29,52.07 27.43,50.93 R6.2 | LEVEL_TRANSLATOR_3.8 34.29,62.74
  Bottom 0.305: v15.75,62.61 14.61,62.61 14.1,62.1 14.1,60.45 v13.59,59.94 13.59,59.82 16.13,57.28 v17.91,57.28 | v64.39,60.83 64.39,53.85 v64.77,53.47 | v6.35,52.2 6.35,56.01 v7.62,57.28
3V3  (via drill 0.38, 0.5)
  Top 0.203: v41.91,36.96 43.18,35.69 | v34.63,40.05 33.66,41.02 33.27,41.02 MSP432P401R.13 v28.19,35.94 | v12.45,32.77 12.45,33.02 13.46,34.04 v16.13,34.04 | 13.46,22.86 13.46,23.41 U$1.3 13.59,23.54 v13.59,25.15 | 22.73,23.37 24.82,25.45 MSP432P401R.73 | TP3.TP 56.2,35.69 C2.1
  Top 0.254: 43.18,35.69 46.1,32.77 54.74,32.77 55.12,32.39 | 13.46,22.86 13.46,22.35 14.35,21.46 21.97,21.46 v22.73,22.22 22.73,23.37 | R8.1 29.34,13.49 v29.34,16 30.48,17.14 | U$3.3 54.28,30.92 55.12,31.75 55.12,32.39 | 55.12,32.39 57.02,34.29 57.02,34.61 C2.1
  Top 0.305: BATTERY_FC_PINS.3 71.12,45.76 U$2.5 63.59,38.23 59.69,38.23 58.42,36.96 58.42,35.69 57.47,34.74 C2.1 | 30.48,17.14 45.21,17.14 49.53,12.83 49.53,10.01 R2.2
  Bottom 0.203: v16.13,34.04 17.91,34.04 19.68,32.26 20.28,32.26 C8.1 22.86,34.84 22.86,36.96 C7.1 | v41.91,36.96 41.06,37.8 R3.1 39.79,39.33 39.24,39.88 37.85,39.88 CPOL.+ v34.63,40.05 | C7.1 23.68,37.34 | v28.19,35.94 25.07,35.94 C7.1 | v12.45,32.77 12.45,26.8 13.59,25.65 v13.59,25.15
  Bottom 0.254: v29.34,16 23.11,22.22 v22.73,22.22
5VDC  (via drill 0.38, 0.5, 0.6)
  Top 0.203: 8.89,65.15 LEVEL_TRANSLATOR_2.14 | 66.17,61.35 LEVEL_TRANSLATOR1.14
  Top 0.254: ULTRA6.1 11.56,35.69 v12.32,36.45 | R7.1 14.17,16.06 14.16,16.06 13.97,16.26 13.97,18.54 | 13.97,18.54 13.59,18.92 13.59,19.64 U$1.6 | 13.97,18.54 14.17,18.74 U$1.7 14.17,20.39 14.48,20.7 19.05,20.7 20.57,19.18 21.59,19.18 | 52.07,19.18 v52.7,19.18 | 8.76,63.76 LEVEL_TRANSLATOR_2.14 | 54.61,24.51 54.61,25.04 | 54.61,25.04 54.61,25.2 54.28,25.53 U$3.6 | 54.61,25.04 54.94,25.37 U$3.7
  Top 0.305: 45.72,69.98 44.45,71.25 36.83,71.25 ULTRA4.1 31.24,71.75 10.03,71.75 8.89,70.61 ULTRA1.1 8.89,67.94 10.29,66.55 | 45.72,69.98 NAZE32_PINHEAD.2 | 45.72,69.98 46.99,71.25 70.99,71.25 v72.26,69.98 | v6.35,16.64 ULTRA3.1 | 67.94,35.05 66.55,35.05 | 66.55,35.05 66.33,35.05 U$2.3 | U$2.1 63.82,34.86 | 63.82,34.86 64.52,34.16 65.66,34.16 66.55,35.05 | 52.07,19.18 21.59,19.18 | 26.67,64.52 LEVEL_TRANSLATOR_3.14 | 26.8,64.52 26.67,64.52 | 8.89,65.15 10.29,66.55 | 26.67,64.52 25.65,65.53 18.03,65.53 17.02,66.55 | 10.29,66.55 17.02,66.55 | v67.18,62.36 66.17,61.35 | 17.02,66.55 17.02,66.67 17.78,67.44 v20.32,67.44 | v21.59,72.52 v36.83,72.52 | v38.35,65.28 v66.93,65.28 | 54.61,24.51 55.63,23.49 56.52,23.49 v57.4,22.61 57.66,22.61 59.56,24.51 R1.1 | C1.1 60.96,34.67 61.72,33.91 62.87,33.91 63.82,34.86 | 5V_PDB.1 11.57,22.99 14.17,20.39
  Top 0.406: 5V_PDB.1 6.35,22.99 | 6.35,22.99 v5.08,24.26 | v5.08,21.72 6.35,22.99 | ULTRA5.1 69.85,42.04 v68.58,40.77 | 67.94,35.05 v68.58,35.69
  Bottom 0.305: 5.08,33.15 7.62,35.69 ULTRA6.1 | ULTRA1.1 8.89,67.18 9.91,66.17 12.06,66.17 12.7,65.53 12.7,36.83 v12.32,36.45 | v72.26,69.98 ULTRA2.1 74.17,60.45 74.17,53.72 72.39,51.94 ULTRA5.1 | v5.08,21.72 5.08,17.91 v6.35,16.64 | v20.32,67.44 20.45,67.44 20.95,67.94 20.95,71.88 v21.59,72.52 | v36.83,72.52 38.1,71.25 38.1,65.53 v38.35,65.28 | v66.93,65.28 67.18,65.28 67.31,65.15 67.31,62.48 v67.18,62.36 | v52.7,19.18 56.39,19.18 57.4,20.19 v57.4,22.61
  Bottom 0.406: v5.08,24.26 5.08,33.15 | v68.58,40.77 v68.58,35.69
A1  (via drill 0.38)
  Top 0.203: v20.7,41.91 21.3,41.91 MSP432P401R.35 | U$1.4 12.87,26.58 16.54,30.25 v16.54,31.5
  Bottom 0.203: v20.7,41.91 20.53,41.91 arc45 20.39,41.85 15.11,36.58 15.11,32.92 v16.54,31.5
A2  (via drill 0.5)
  Top 0.254: v12.83,18.03 12.83,19.67 U$1.5
  Bottom 0.254: MOTHERBOARD_UART.1 22.86,14.22 21.72,15.37 15.49,15.37 v12.83,18.03
B1  (via drill 0.38, 0.5)
  Top 0.203: MSP432P401R.34 21.38,42.55 21.34,42.55 20.95,42.93 17.27,42.93 v16.89,42.55 | v14.99,25.65 14.99,23.63 U$1.1
  Bottom 0.203: v16.89,42.55 13.34,38.99 13.34,29.46 14.86,27.94 14.86,25.78 v14.99,25.65
B2  (via drill 0.5)
  Top 0.254: U$1.8 14.82,19.47
  Top 0.305: 14.82,19.47 17.14,17.14 23.88,17.14 v25.27,15.75
  Bottom 0.305: v25.27,15.75 25.27,7.24 MOTHERBOARD_UART.2
DEBUG_RESET  (via drill 0.38)
  Top 0.203: v40.18,23.49 34.07,23.49 MSP432P401R.83
  Top 0.254: 46.58,5.3 C13.1 | 46.8,4.12 46.8,4 47.62,3.17 53.09,3.17 54.61,4.7 54.61,6.17
  Top 0.305: C13.1 46.8,4.12 | U$4.3 54.61,6.17 55.07,6.63 U$4.4 | JTAG_DEBUG.10 43.31,8.38 43.94,7.75 45.34,7.75 | 45.34,7.75 46.61,9.02 46.61,9.88 R2.1 | 46.58,5.3 46.58,6.5 45.34,7.75
  Bottom 0.254: v40.18,23.49 40.77,23.49 41.91,22.35 41.91,11.81 43.31,10.41 JTAG_DEBUG.10
DEBUG_SWCLK  (via drill 0.38)
  Top 0.203: MSP432P401R.95 36.7,29.34 36.73,29.34 v37.08,28.98
  Bottom 0.203: 36.83,27.86 37.16,28.19 37.16,28.9 v37.08,28.98
  Bottom 0.254: 36.83,27.86 36.83,26.04 35.69,24.89 JTAG_DEBUG.4
DEBUG_SWDIO  (via drill 0.38)
  Top 0.203: MSP432P401R.94 34.18,31.1 35.05,30.23 35.08,30.23 36.12,29.18 v36.12,28.47
  Bottom 0.203: v36.12,28.47 36.12,27.1 33.15,24.13
  Bottom 0.254: 33.15,24.13 JTAG_DEBUG.2
DEBUG_SWO  (via drill 0.38)
  Top 0.203: MSP432P401R.93 33.85,30.79 35.05,29.59 35.05,28.57 37.77,25.86 v37.77,25.78
  Bottom 0.254: v37.77,25.78 37.77,10.74 38.23,10.29 JTAG_DEBUG.6
DEBUG_TDI  (via drill 0.38)
  Top 0.203: MSP432P401R.92 33.48,30.4 34.29,29.59 34.29,28.12 37.82,24.59 v39.12,24.59
  Bottom 0.203: v39.12,24.59 39.37,24.33
  Bottom 0.254: 39.37,24.33 39.37,10.79 40.77,9.4 JTAG_DEBUG.8
GND  (via drill 0.38, 0.5)
  Top 0.203: MSP432P401R.43 18.8,38.77 18.8,39.12 19.56,39.88 19.81,39.88 MSP432P401R.40 21.34,38.35 21.97,38.35 v22.1,38.48 | MSP432P401R.82 29.21,27.64 v29.21,28.32 29.97,28.32 30.64,27.65 MSP432P401R.84 | v25.91,27.3 24.46,25.86 MSP432P401R.72 22.48,23.88 21.59,23.88 19.81,22.1 | MSP432P401R.15 34.67,43.82 36.2,43.82 v36.7,43.31
  Top 0.254: LEVEL_TRANSLATOR_3.7 34.42,58.29 34.42,58.03 34.92,57.53 v35.94,57.53 | MSP432P401R.15 | R6.1 34.16,50.93 v34.54,51.31 | v9.78,28.19 10.44,28.85 POWER_LED.C | U$1.2 14.22,23.41 14.22,22.61 14.73,22.1 19.81,22.1 | U$3.2
  Top 0.305: LEVEL_TRANSLATOR_2.7 16.77,58.55 v19.05,58.55 | R5.1 18.54,50.93 19.18,51.56 v19.18,52.07
  Bottom 0.203: v29.21,28.32 27.98,29.55 C3.2 27.69,29.34 27.69,29.08 v25.91,27.3 | v22.1,38.48 23.24,39.62 24.08,39.62 C7.2 24.86,38.9 26.92,36.83 29.41,36.83 CPOLARIZED.2 | v36.7,43.31 37.08,42.93 37.08,42.29 36.32,41.53 36.2,41.53 CPOL.-
  Bottom 0.254: v34.54,51.31 36.58,53.34 36.58,57.02 36.07,57.53 v35.94,57.53 | 5V_PDB.2 9.78,26.16 v9.78,28.19
  Bottom 0.305: v19.18,52.07 19.18,58.42 v19.05,58.55
  pour Bottom: 0,76.33 0,0.13 81.28,0.13 81.28,76.33
  pour Top: 0,76.33 0,0.13 81.28,0.13 81.28,76.33
LED1_SIGNAL
  Top 0.203: MSP432P401R.47 18.92,35.81 18.92,35.43 18.03,34.54 16.64,34.54 16.26,34.93
  Top 0.254: R9.2 9.84,33.97 10.79,34.93 16.26,34.93
LED2_SIGNAL
  Top 0.203: 16.64,37.34 17.71,36.27 MSP432P401R.48
  Top 0.254: 16.64,37.34 10.54,37.34 10.16,36.96 7.49,36.96 6.1,38.35 6.1,44.83 7.75,46.48 7.75,46.92 R10.2
N$2  (via drill 0.38)
  Top 0.203: MSP432P401R.45 v23.24,32.89 23.62,32.89 26.67,35.94 26.67,36.7 v29.72,39.75 | v30.48,29.84 30.52,29.84 MSP432P401R.87
  Bottom 0.203: v30.48,29.84 29.43,30.9 C3.1 24.42,30.9 24.38,30.93 | v23.24,32.89 24.38,31.75 24.38,30.93 | 24.38,30.93 C4.1 | v29.72,39.75 30.1,40.13 31.37,40.13 32.26,39.24 36.45,39.24 37.72,37.97 38.27,37.97 R3.2
N$5
  Top 0.254: POWER_LED.A 7.59,32.29 R9.1
N$6
  Top 0.254: LED2.A 6.5,50.9 9.27,48.13 9.27,47.69 R10.1
N$14
  Top 0.305: R8.2 32.16,10.57 31.24,9.65 31.24,7.87 JTAG_DEBUG.1
P2.2_RX  (via drill 0.38, 0.5)
  Top 0.203: MSP432P401R.18 30.3,41.6 v33.02,44.32 | v35.31,46.61 v53.85,46.61
  Top 0.254: v53.65,31.62 53.65,29.95 U$3.4
  Bottom 0.203: v33.02,44.32 v35.31,46.61 | v53.85,46.61 55.37,46.61 56.77,45.21
  Bottom 0.254: 56.77,32.89 56.77,32.77 56.21,32.21 54.23,32.21 v53.65,31.62
  Bottom 0.305: 56.77,45.21 56.77,32.89
P2.4_PWM_J4.38  (via drill 0.38)
  Top 0.203: MSP432P401R.20 32.64,45.34 65.53,45.34 66.04,45.85 v66.04,46.48
  Bottom 0.203: v66.04,46.48 NAZE32_PINHEAD.10
P2.5_PWM_J2.19  (via drill 0.5)
  Top 0.203: MSP432P401R.21 29.29,42.62 32.51,45.85 62.23,45.85 v63.5,47.12
  Bottom 0.254: NAZE32_PINHEAD.9 v63.5,47.12
P2.6_PWM_J4.39  (via drill 0.38)
  Top 0.203: MSP432P401R.22 33.4,47.5 59.69,47.5 v60.96,48.77
  Bottom 0.203: v60.96,48.77 NAZE32_PINHEAD.8
P2.7_PWM_J4.40  (via drill 0.38)
  Top 0.203: v58.42,49.4 57.4,48.39 33.53,48.39 28.52,43.38 MSP432P401R.23
  Bottom 0.203: NAZE32_PINHEAD.7 v58.42,49.4
P4.0_GPIO  (via drill 0.38, 0.5)
  Top 0.203: MSP432P401R.56 15.75,28.45 15.75,26.92 v16,26.67 | v19.3,18.54 19.68,18.16 45.97,18.16 49.4,14.73 v51.44,14.73
  Bottom 0.203: v16,26.67 18.54,24.13 18.54,19.3 v19.3,18.54 | v51.44,14.73 68.71,14.73 69.72,13.72 74.04,13.72 75.18,14.86 75.18,24.38 73.79,25.78 72.64,25.78 GPIO_EXTRA.1
P4.1_GPIO  (via drill 0.38)
  Top 0.203: MSP432P401R.57 19.21,31.15 16.26,28.19 16.26,27.81 v16.89,27.18
  Top 0.254: v24,20.07 68.2,20.07 71.12,22.99 GPIO_EXTRA.2
  Bottom 0.254: v16.89,27.18 19.43,24.64 19.43,23.75 22.1,21.08 22.99,21.08 v24,20.07
P4.5_GPIO  (via drill 0.38)
  Top 0.203: MSP432P401R.61 22.35,31.5 28.32,31.5 v32.89,36.07 | v38.35,34.54 v49.28,23.62
  Bottom 0.203: v38.35,34.54 36.83,36.07 v32.89,36.07
  Bottom 0.254: v49.28,23.62 50.04,22.86 50.04,18.8 50.55,18.29 69.6,18.29 71.75,20.45 GPIO_EXTRA.3
P4.6_GPIO  (via drill 0.38)
  Top 0.203: MSP432P401R.62 20.92,29.43 21.05,29.43 22.48,30.86 29.34,30.86 33.78,35.31 v34.29,35.31 | v37.08,34.29 v48.77,22.61
  Bottom 0.203: v37.08,34.29 36.07,35.31 v34.29,35.31
  Bottom 0.254: v48.77,22.61 48.77,18.41 49.78,17.4 71.88,17.4 GPIO_EXTRA.4
P4.7_GPIO  (via drill 0.38)
  Top 0.203: MSP432P401R.63 22.35,30.1 29.59,30.1 33.78,34.29 36.07,34.29 v47.37,22.99
  Bottom 0.203: v47.37,22.99 47.37,17.78 49.28,15.88
  Bottom 0.254: 49.28,15.88 71.88,15.88 GPIO_EXTRA.5
P5.6  (via drill 0.38)
  Top 0.254: LEVEL_TRANSLATOR_3.2 27.94,55.37 27.3,54.74 v27.3,52.96 | v24.26,49.91 20.57,49.91 v20.32,49.66 | v21.21,25.4 22.61,25.4 MSP432P401R.70
  Bottom 0.254: v27.3,52.96 v24.26,49.91 | v20.32,49.66 17.78,47.12 17.78,41.91 14.1,38.23 14.1,32.51 v21.21,25.4
P5.6_5V  (via drill 0.38, 0.5, 0.6)
  Top 0.254: v35.56,58.55 44.96,58.55 v46.1,57.4 | v46.74,42.93 v66.55,42.93
  Top 0.305: LEVEL_TRANSLATOR_3.13 v27.94,61.72 | v67.31,37.47 67.82,36.96 ULTRA5.3
  Bottom 0.254: v46.1,57.4 46.1,43.56 v46.74,42.93 | v66.55,42.93 67.18,42.29 67.18,37.59 v67.31,37.47
  Bottom 0.305: v27.94,61.72 31.11,58.55 v35.56,58.55
P5.7  (via drill 0.38)
  Top 0.203: MSP432P401R.71 22.4,24.51 v20.83,24.51
  Top 0.254: LEVEL_TRANSLATOR_3.3 29.21,54.61 v28.7,54.1 | v9.91,53.21 24.13,53.21 v24.38,53.47 | v6.35,49.66 4.83,48.13 4.83,34.67 5.59,33.91 5.59,27.94 6.35,27.18 11.68,27.18 v14.35,29.84
  Bottom 0.254: v28.7,54.1 25.02,54.1 v24.38,53.47 | v6.35,49.66 v9.91,53.21 | v14.35,29.84 15.49,29.84 v20.83,24.51
P5.7_5V  (via drill 0.38, 0.6)
  Top 0.305: LEVEL_TRANSLATOR_3.12 v29.21,62.1 | v38.48,59.56 49.15,59.56 49.78,60.2 v49.78,60.33 | v49.78,64.01 50.29,64.52 74.04,64.52 v75.56,62.99
  Bottom 0.305: v29.21,62.1 31.75,59.56 v38.48,59.56 | v49.78,60.33 v49.78,64.01 | ULTRA5.2 74.42,39.5 75.56,40.64 v75.56,62.99
P6.6  (via drill 0.38)
  Top 0.254: LEVEL_TRANSLATOR_3.4 30.48,58.42 | v45.72,21.84 33.6,21.84 MSP432P401R.80
  Top 0.305: 30.48,58.42 30.48,58.55 31.75,59.82 34.67,59.82 36.07,61.21 41.4,61.21 v41.78,60.83
  Bottom 0.305: v41.78,60.83 41.78,42.55 43.18,41.15 45.09,41.15 46.35,39.88 46.35,22.48 v45.72,21.84
P6.6_5V  (via drill 0.38)
  Top 0.305: 30.48,63.12 LEVEL_TRANSLATOR_3.11 30.48,61.34 29.84,60.71 22.48,60.71 v21.21,59.44 | v20.57,46.99 v15.24,46.99 | v14.22,42.42 12.57,40.77 ULTRA6.3
  Bottom 0.305: v15.24,46.99 14.22,45.97 v14.22,42.42 | v21.21,59.44 21.21,47.62 v20.57,46.99
P6.7  (via drill 0.38)
  Top 0.254: MSP432P401R.81 33.52,22.61 42.16,22.61 v43.2,23.65 | LEVEL_TRANSLATOR_3.5 31.75,57.66 31.88,57.66 32.77,56.77 39.37,56.77 v39.75,56.39 39.5,56.64
  Bottom 0.254: 43.18,33.66 43.18,36.96 40.77,39.37 40.77,55.37 v39.75,56.39 | 43.18,33.66 43.18,33.15 | v43.2,23.65 43.2,33.63 43.18,33.66
P6.7_5V  (via drill 0.38)
  Top 0.305: ULTRA6.2 v15.49,38.23 | v30.99,65.02 31.37,65.02 31.75,64.64 LEVEL_TRANSLATOR_3.10
  Bottom 0.305: v15.49,38.23 22.1,44.83 22.1,58.04 24.26,60.2 24.26,63.37 24.77,63.88 29.84,63.88 v30.99,65.02
P7.4  (via drill 0.38)
  Top 0.203: MSP432P401R.26 arc45 25.5,44.1 24.77,44.83 24.77,45.09 v25.27,45.59 | v34.29,54.48 v42.93,54.48 | v44.07,63.12 55.5,63.12 v55.88,63.5
  Bottom 0.203: v25.27,45.59 25.4,45.59 v34.29,54.48 | 43.81,62.74 43.81,62.87 v44.07,63.12
  Bottom 0.254: NAZE32_PINHEAD.6 v55.88,63.5 | 43.81,62.74 43.81,55.37 v42.93,54.48
P7.5  (via drill 0.38)
  Top 0.203: MSP432P401R.27 arc-45 25.1,43.74 24.26,44.58 24.26,45.59 v25.65,46.99 | v32.38,53.59 v52.07,53.59
  Bottom 0.203: NAZE32_PINHEAD.5 53.34,54.74 52.26,53.65 arc-45 52.11,53.59 v52.07,53.59 | v25.65,46.99 v32.38,53.59
P7.6  (via drill 0.38)
  Top 0.203: MSP432P401R.28 23.75,44.41 23.75,46.23 v24.13,46.61 | v30.35,52.83 v49.4,52.83
  Bottom 0.203: v24.13,46.61 v30.35,52.83 | v49.4,52.83 50.04,52.83 50.8,53.98
  Bottom 0.254: NAZE32_PINHEAD.4 50.8,53.98
P7.7  (via drill 0.38, 0.5)
  Top 0.203: MSP432P401R.29 23.24,44.2 23.24,46.99 v23.75,47.5 | v31.24,55.12 33.78,55.12 33.91,55.25 35.31,55.25 35.43,55.12 42.55,55.12 42.93,55.5 46.99,55.5 v47.12,55.37
  Bottom 0.203: v23.75,47.5 v31.24,55.12 | v47.12,55.37 47.62,55.37 48.26,56.01
  Bottom 0.254: NAZE32_PINHEAD.3 48.26,56.01
P8.0  (via drill 0.38)
  Top 0.203: 24.1,42.57 MSP432P401R.30 24.77,41.96 24.77,41.91 v26.67,41.91 | LEVEL_TRANSLATOR1.2 58.67,59.82 58.17,59.31 57.78,59.31 v57.66,59.18 | v37.97,50.04 v56.39,50.04
  Bottom 0.203: v56.39,50.04 57.28,50.93 57.28,58.8 v57.66,59.18 | v26.67,41.91 28.19,41.91 36.32,50.04 v37.97,50.04
P8.0_5V  (via drill 0.38)
  Top 0.305: ULTRA1.2 13.59,70.87 18.29,70.87 19.05,70.1 v19.05,69.98 | v20.07,66.42 61.98,66.42 v62.23,66.17 | v62.48,59.82 LEVEL_TRANSLATOR1.13
  Bottom 0.305: v19.05,69.98 19.18,69.85 19.18,66.55 19.3,66.42 v20.07,66.42 | v62.23,66.17 62.23,60.07 v62.48,59.82
P8.1  (via drill 0.38)
  Top 0.203: MSP432P401R.31 25.02,41.02 v27.69,41.02 | LEVEL_TRANSLATOR1.3 59.69,58.55 58.55,57.4 50.93,57.4 v48.01,54.48 | v37.21,44.58 v47.24,44.58
  Bottom 0.203: v48.01,54.48 48.01,45.34 v47.24,44.58 | v37.21,44.58 34.29,44.58 30.73,41.02 v27.69,41.02
P8.1_5V  (via drill 0.38, 0.5)
  Top 0.305: v14.73,73.41 v68.33,73.41 | v69.47,59.94 68.2,58.67 66.3,58.67 LEVEL_TRANSLATOR1.12
  Bottom 0.305: ULTRA1.3 13.97,72.64 v14.73,73.41 | v69.47,59.94 69.47,72.26 v68.33,73.41
P8.2  (via drill 0.38)
  Top 0.203: v14.73,41.4 14.61,41.28 14.61,40.89 18.46,37.04 MSP432P401R.46 | v19.94,50.8 24.77,50.8 26.29,49.28 v51.82,49.28 | v53.72,53.59 57.78,53.59 58.42,54.23
  Top 0.254: 59.69,57.28 58.42,56.01 58.42,54.23
  Top 0.279: LEVEL_TRANSLATOR1.4 59.69,57.28
  Bottom 0.203: v14.73,41.4 16.64,43.31 16.64,47.5 v19.94,50.8 | v53.72,53.59 52.96,52.83 52.96,49.91 52.32,49.28 v51.82,49.28
P8.2_5V
  Top 0.305: LEVEL_TRANSLATOR1.11 69.72,57.28 ULTRA2.2
P9.2  (via drill 0.38)
  Top 0.203: MSP432P401R.74 23.94,23.89 arc45 23.88,23.74 v23.88,23.24 | v26.92,20.83 v43.31,20.83
  Top 0.254: v58.93,40.77 45.72,40.77 v44.45,39.5 | LEVEL_TRANSLATOR1.5 59.82,56.01 59.31,55.5 v59.31,54.99
  Bottom 0.203: v23.88,23.24 26.23,20.89 arc45 26.37,20.83 v26.92,20.83 | v43.31,20.83 44.39,21.91 arc45 44.45,22.05 44.45,22.1
  Bottom 0.254: v59.31,54.99 59.31,41.02 59.05,40.77 v58.93,40.77
  Bottom 0.305: v44.45,39.5 44.45,22.1
P9.2_5V
  Top 0.305: LEVEL_TRANSLATOR1.10 70.99,56.01 ULTRA2.3
P9.3  (via drill 0.38, 0.5, 0.6)
  Top 0.203: 25.52,24.76 MSP432P401R.75 25.4,24.67
  Top 0.254: v22.23,20.17 22.25,20.17 24.89,22.81 24.89,24.16 MSP432P401R.75
  Top 0.305: v1.78,54.74 1.78,55.25 2.54,56.01 8.89,56.01 10.16,57.28 LEVEL_TRANSLATOR_2.2 | v21.44,16.13 21.16,15.85 21.13,15.85 17.17,11.89 12.29,11.89 10.26,13.92 10.26,15.8 8.03,18.03 4.95,18.03 v1.78,21.21
  Bottom 0.254: v21.44,16.13 21.44,19.38 v22.23,20.17
  Bottom 0.305: v1.78,54.74 v1.78,21.21
P9.3_5V  (via drill 0.7)
  Top 0.305: v5.08,59.82 8.89,59.82 10.16,61.09 LEVEL_TRANSLATOR_2.13
  Bottom 0.305: v5.08,59.82 4.45,59.82 3.05,58.42 3.05,17.4 8.89,11.56 ULTRA3.2
P10.3  (via drill 0.38, 0.6)
  Top 0.254: v39.24,40.89 39.24,39.91 MSP432P401R.3 | v31.62,56.39 32,56.01 v37.97,56.01
  Top 0.305: LEVEL_TRANSLATOR_2.5 13.97,57.02 14.61,56.39 v23.24,56.39
  Bottom 0.254: v23.24,56.39 v31.62,56.39 | v39.24,40.89 39.24,54.74 v37.97,56.01
P10.3_GPIO5V  (via drill 0.38)
  Top 0.254: 28.45,70.87 22.99,70.87 v22.48,70.36
  Top 0.305: LEVEL_TRANSLATOR_2.10 13.97,62.36 15.37,60.96 21.34,60.96 v21.84,61.47 | 28.45,70.87 29.21,70.1 ULTRA4.3
  Bottom 0.305: v22.48,70.36 22.1,69.98 22.1,61.72 v21.84,61.47
P10.4  (via drill 0.38)
  Top 0.203: LEVEL_TRANSLATOR_2.3 11.43,56.01 12.95,54.48 v14.73,54.48 | v16.26,48.39 28.57,48.39 30.23,46.74 30.23,45.72 28.21,43.7 MSP432P401R.24
  Bottom 0.203: v14.73,54.48 14.99,54.48 15.49,53.98 15.49,49.15 v16.26,48.39
P10.4_5V  (via drill 0.7)
  Top 0.305: v11.43,61.09 LEVEL_TRANSLATOR_2.12
  Bottom 0.305: ULTRA3.3 v11.43,61.09
P10.5  (via drill 0.38)
  Top 0.203: MSP432P401R.25 27.79,44.04 v26.8,43.05
  Top 0.305: LEVEL_TRANSLATOR_2.4 12.7,57.02 14.48,55.25 22.23,55.25 v22.86,54.61
  Bottom 0.203: v26.8,43.05 23.5,43.05 22.86,43.69 v22.86,54.61
P10.5_5V  (via drill 0.5)
  Top 0.254: v13.84,65.41 16.76,65.41 17.91,64.26 v23.5,64.26
  Top 0.305: v13.84,65.41 13.21,65.41 12.7,64.9 LEVEL_TRANSLATOR_2.11
  Bottom 0.254: v23.5,64.26 24.77,65.53 29.84,65.53 31.75,67.44
  Bottom 0.305: ULTRA4.2 31.75,67.44
VBAT_TX  (via drill 0.5)
  Top 0.254: U$3.5 53.65,26.18 53.65,26.87 53.98,27.2 v63.3,27.2
  Bottom 0.254: 64.54,28.45 v63.3,27.2
  Bottom 0.305: BATTERY_FC_PINS.1 68.83,49.66 67.18,48.01 67.18,44.83 64.54,42.19 64.54,28.45
VCORE  (via drill 0.38)
  Top 0.203: MSP432P401R.12 31.88,38.91 31.88,38.86 31.62,38.61 31.62,37.97 v31.88,37.72
  Bottom 0.203: 40.55,33.57 L1.1 40.31,33.15 36.83,33.15 36.16,33.82 C11.1 | 31.88,36.01 CPOLARIZED.1 31.88,36.64 v31.88,37.72
  Bottom 0.254: C11.1 33.69,34 CPOLARIZED.1
VSW  (via drill 0.5)
  Top 0.203: MSP432P401R.14 31.7,40.21 33.15,41.66 34.16,41.66 35.81,40.01 35.81,38.61 v36.07,38.35
  Bottom 0.203: L1.2 40.59,35.31 39.12,35.31 v36.07,38.35

### Text on the board
tPlace: GND | 5VDC | P7.7 | P7.6 | P7.5 | P7.4 | P2.7 | P2.6 | P2.5 | P2.4 | 3V3 | GND | ECE477 Team 9 | Archit Aggarwal | Shubham Agrawal | Sheik Dawood | D-3MQ | Akash Kumar | RESET SWITCH | 1 | GNDs | rev 3.0
tNames: Trig | GND | GND | Echo | Trig | 5VDC | 5VDC | Echo | 5VDC | Trig | Echo | GND | VBAT_TX | 3V3 | 5VDC | GND | Echo | Trig | Trig | Echo | 5VDC | GND | LDO Regulator | GND | P4.0 | VIN | P4.1 | P4.5 | P4.6 | P4.7 | Echo | TX | RX | Trig | GND | 5VDC